# EAGLE schematic kocka1 (EAGLE 7.2.0)

## Sheet 1 of 2
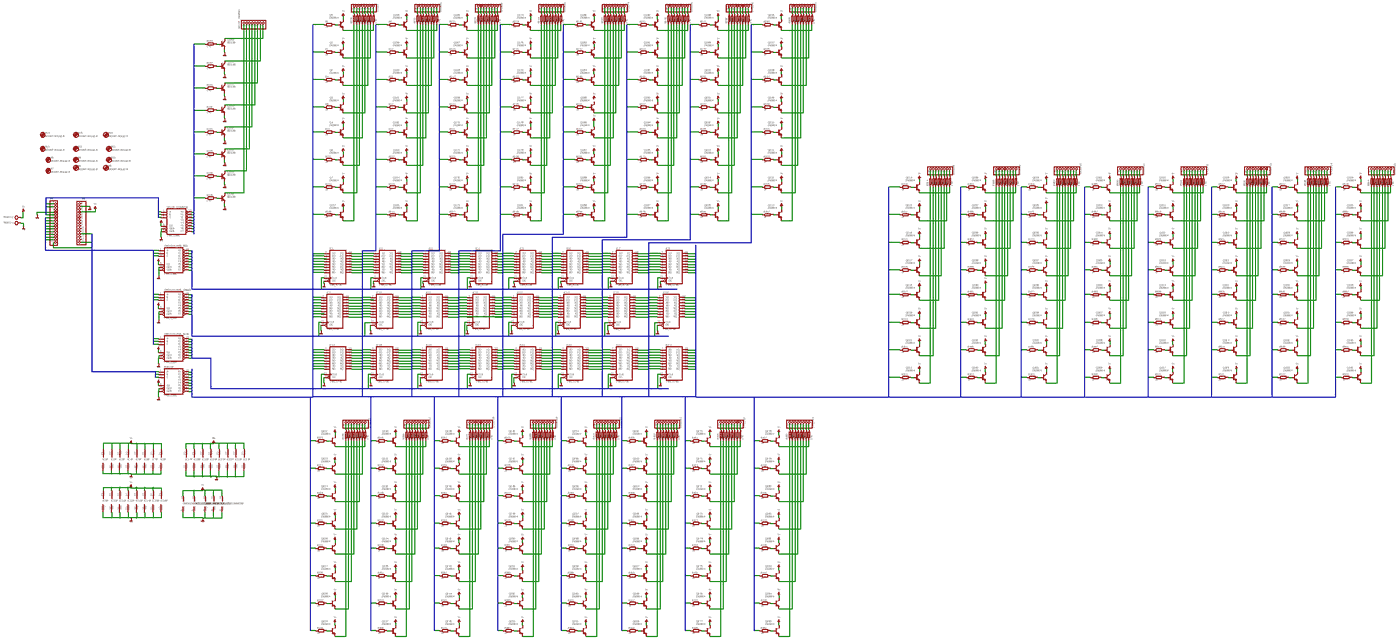
[diagram p0: schematic, sheet 1, overview]
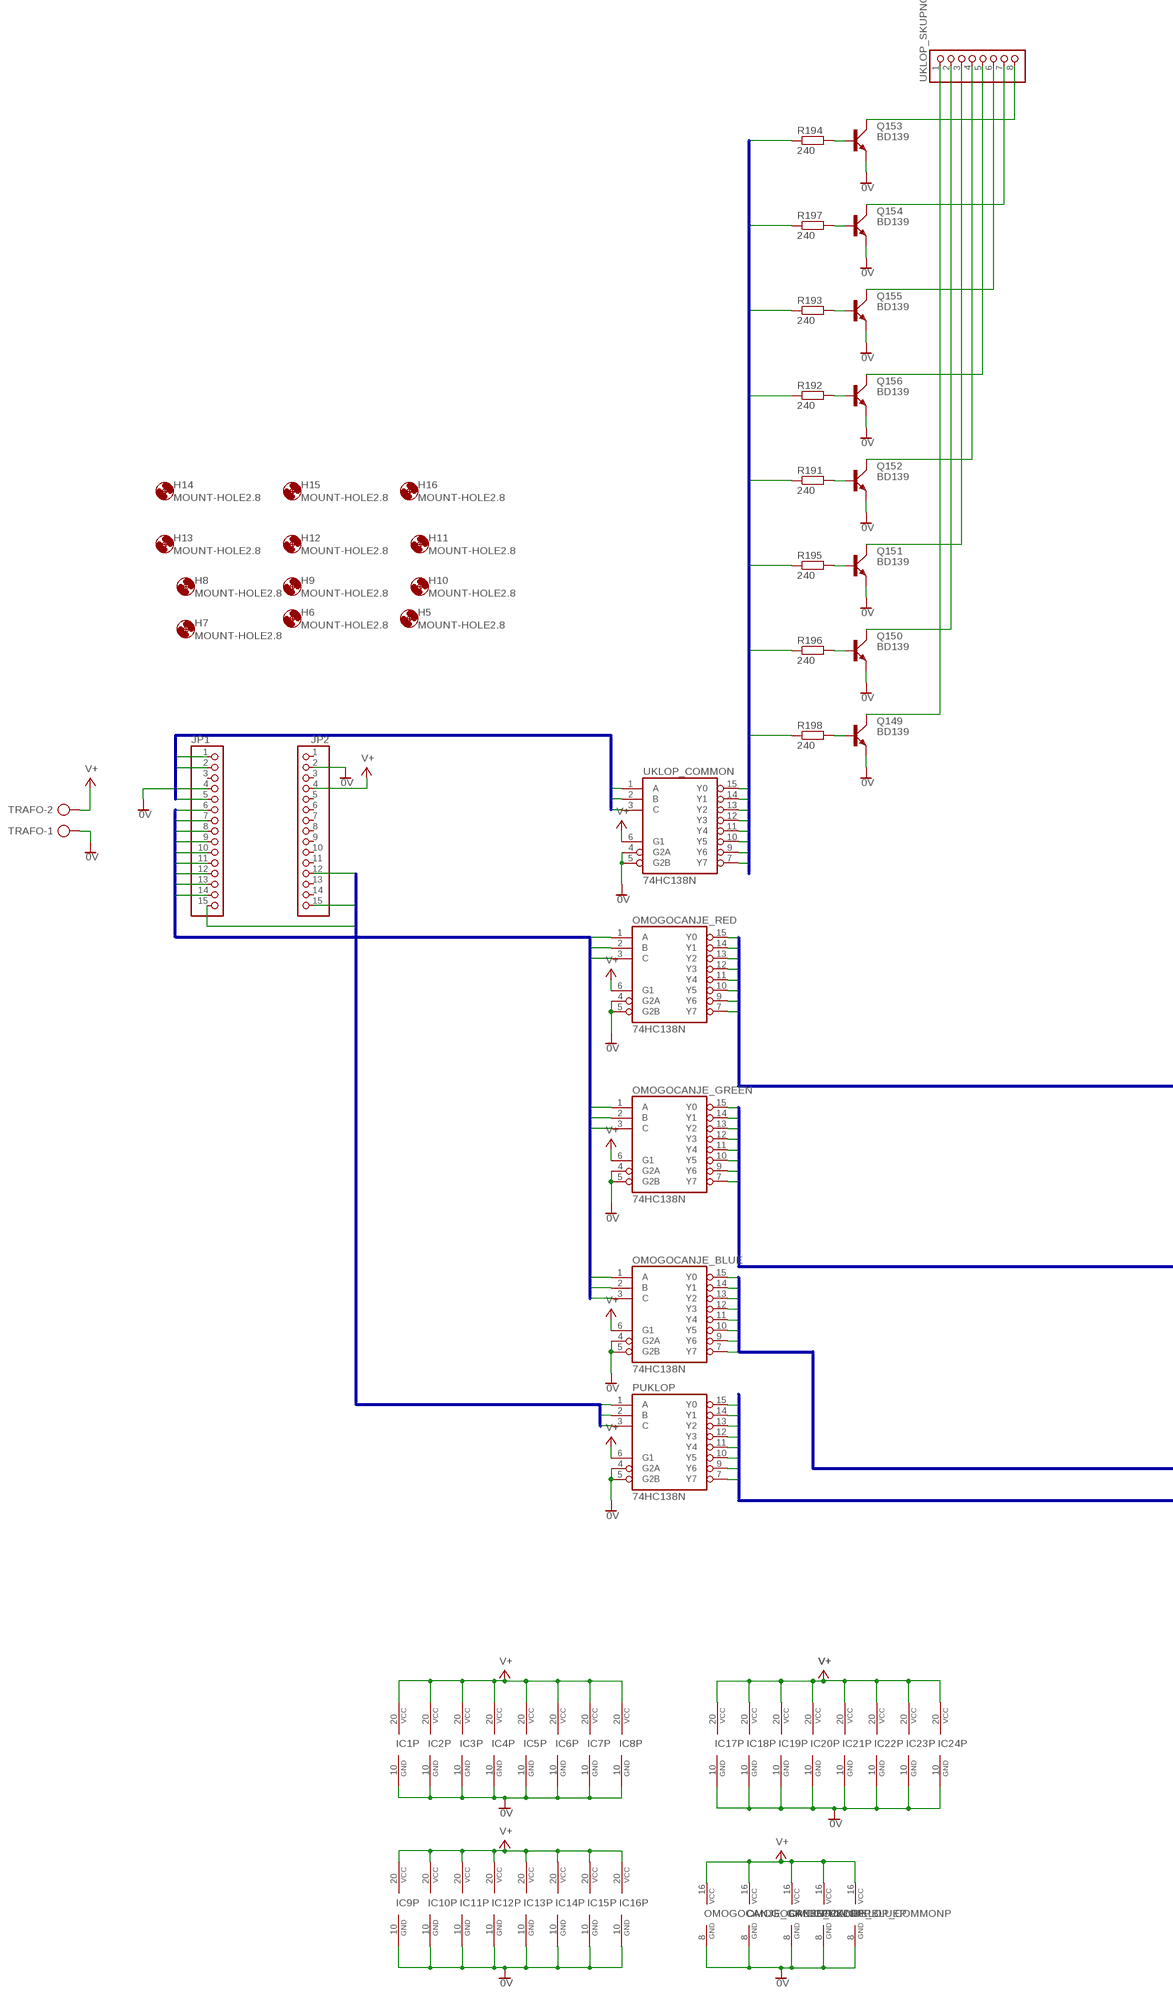
[diagram p1: schematic, sheet 1, part 1 of 4]
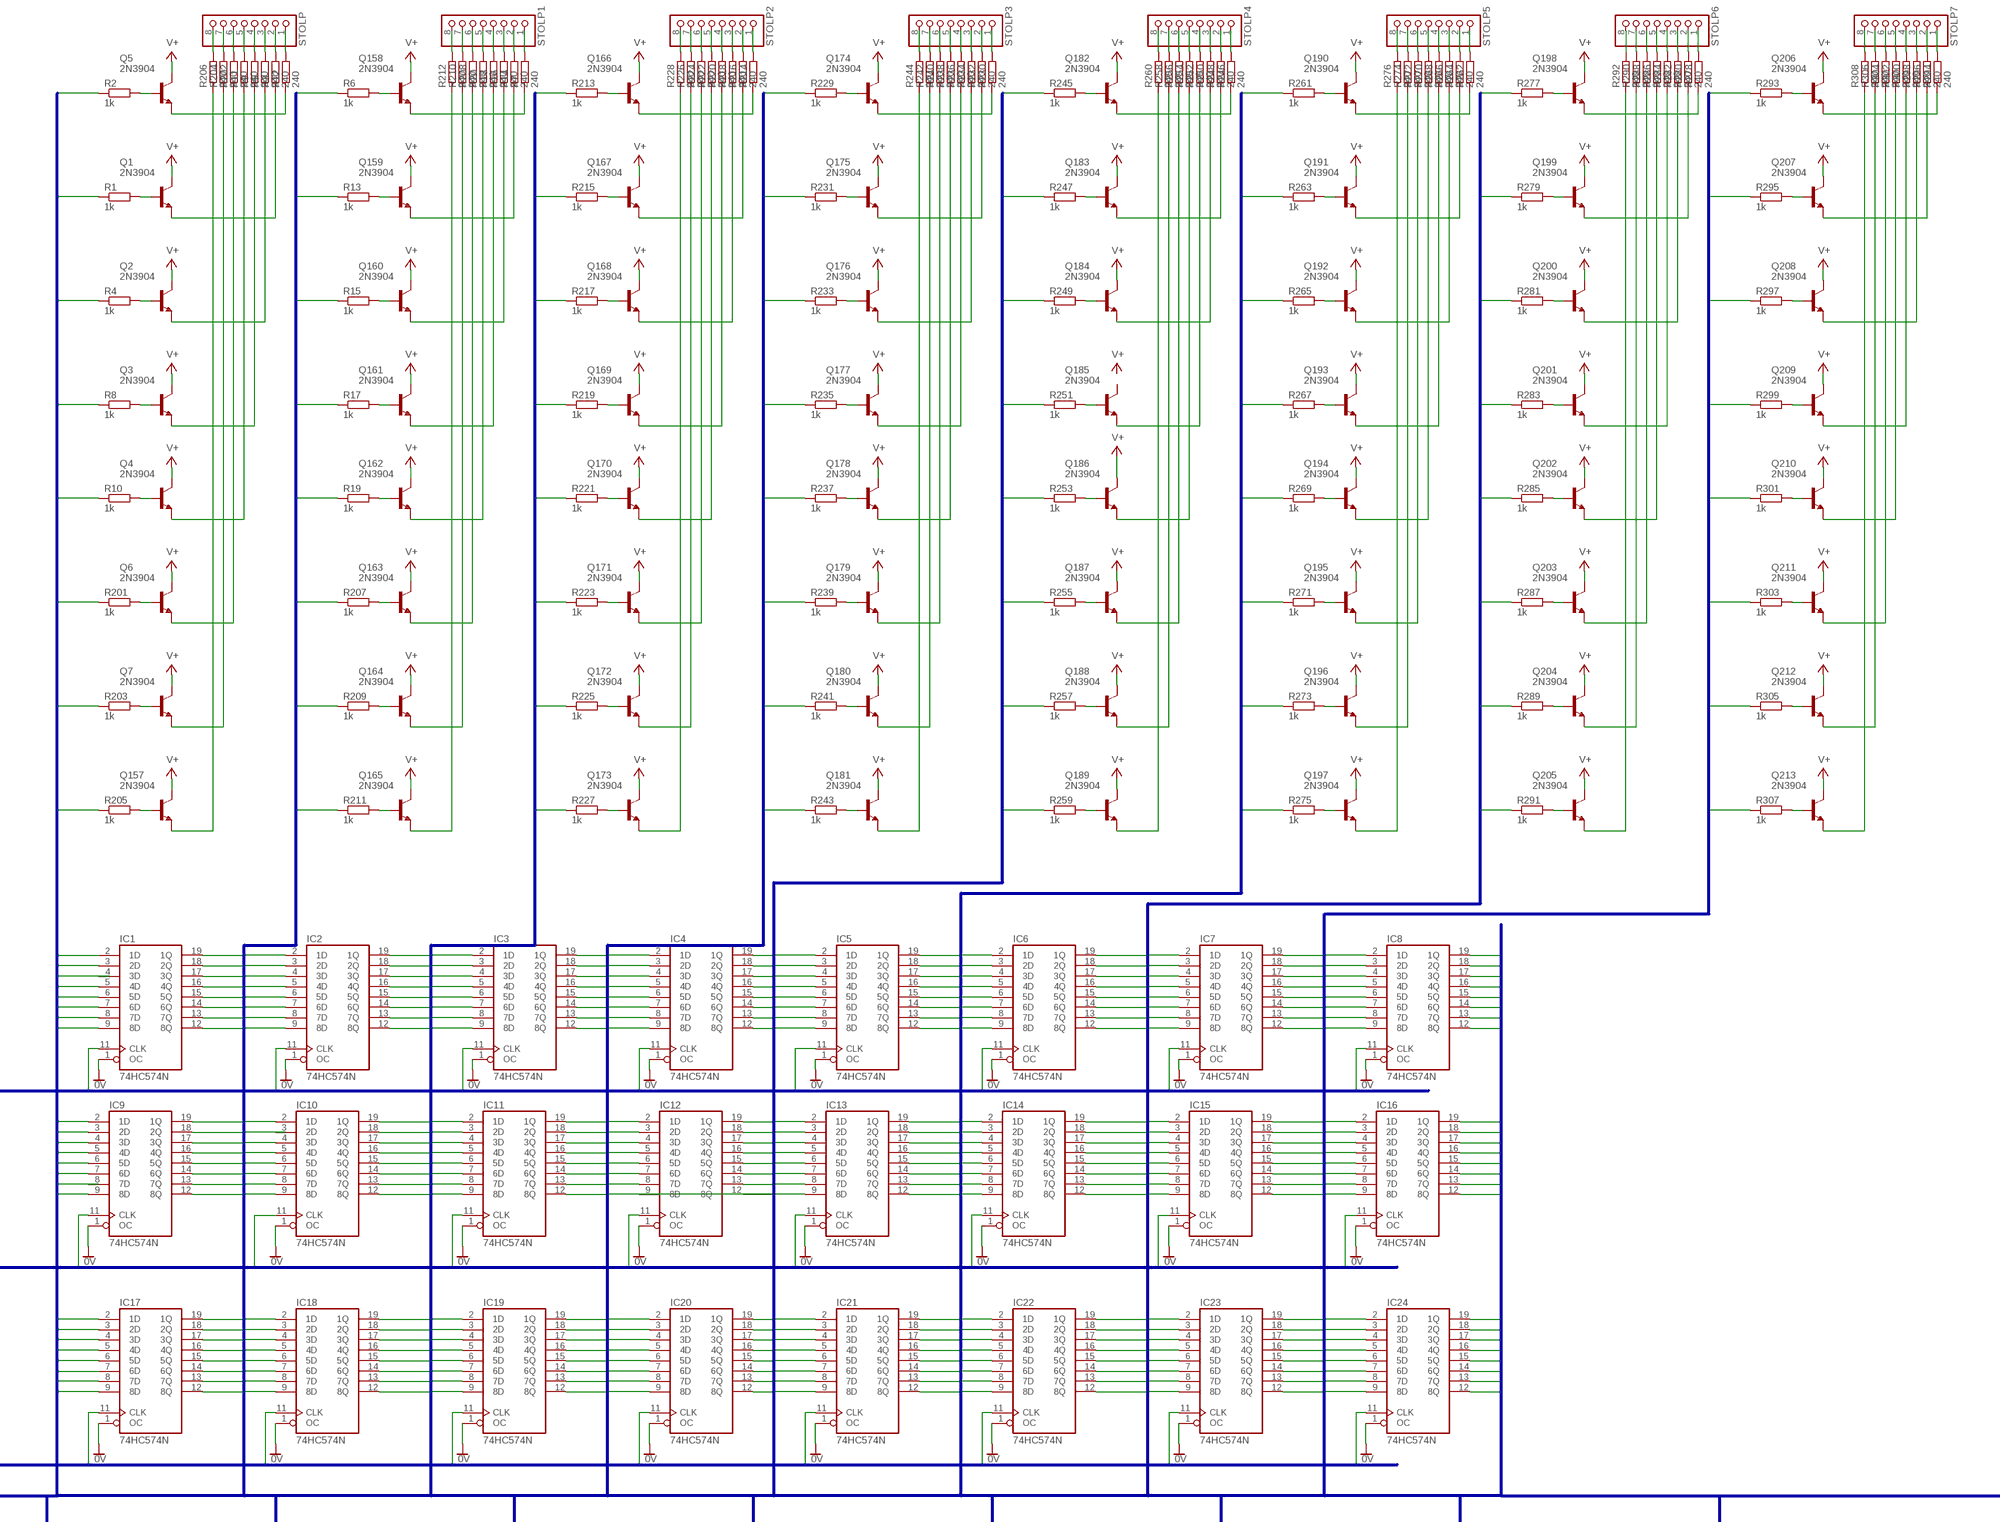
[diagram p2: schematic, sheet 1, part 2 of 4]
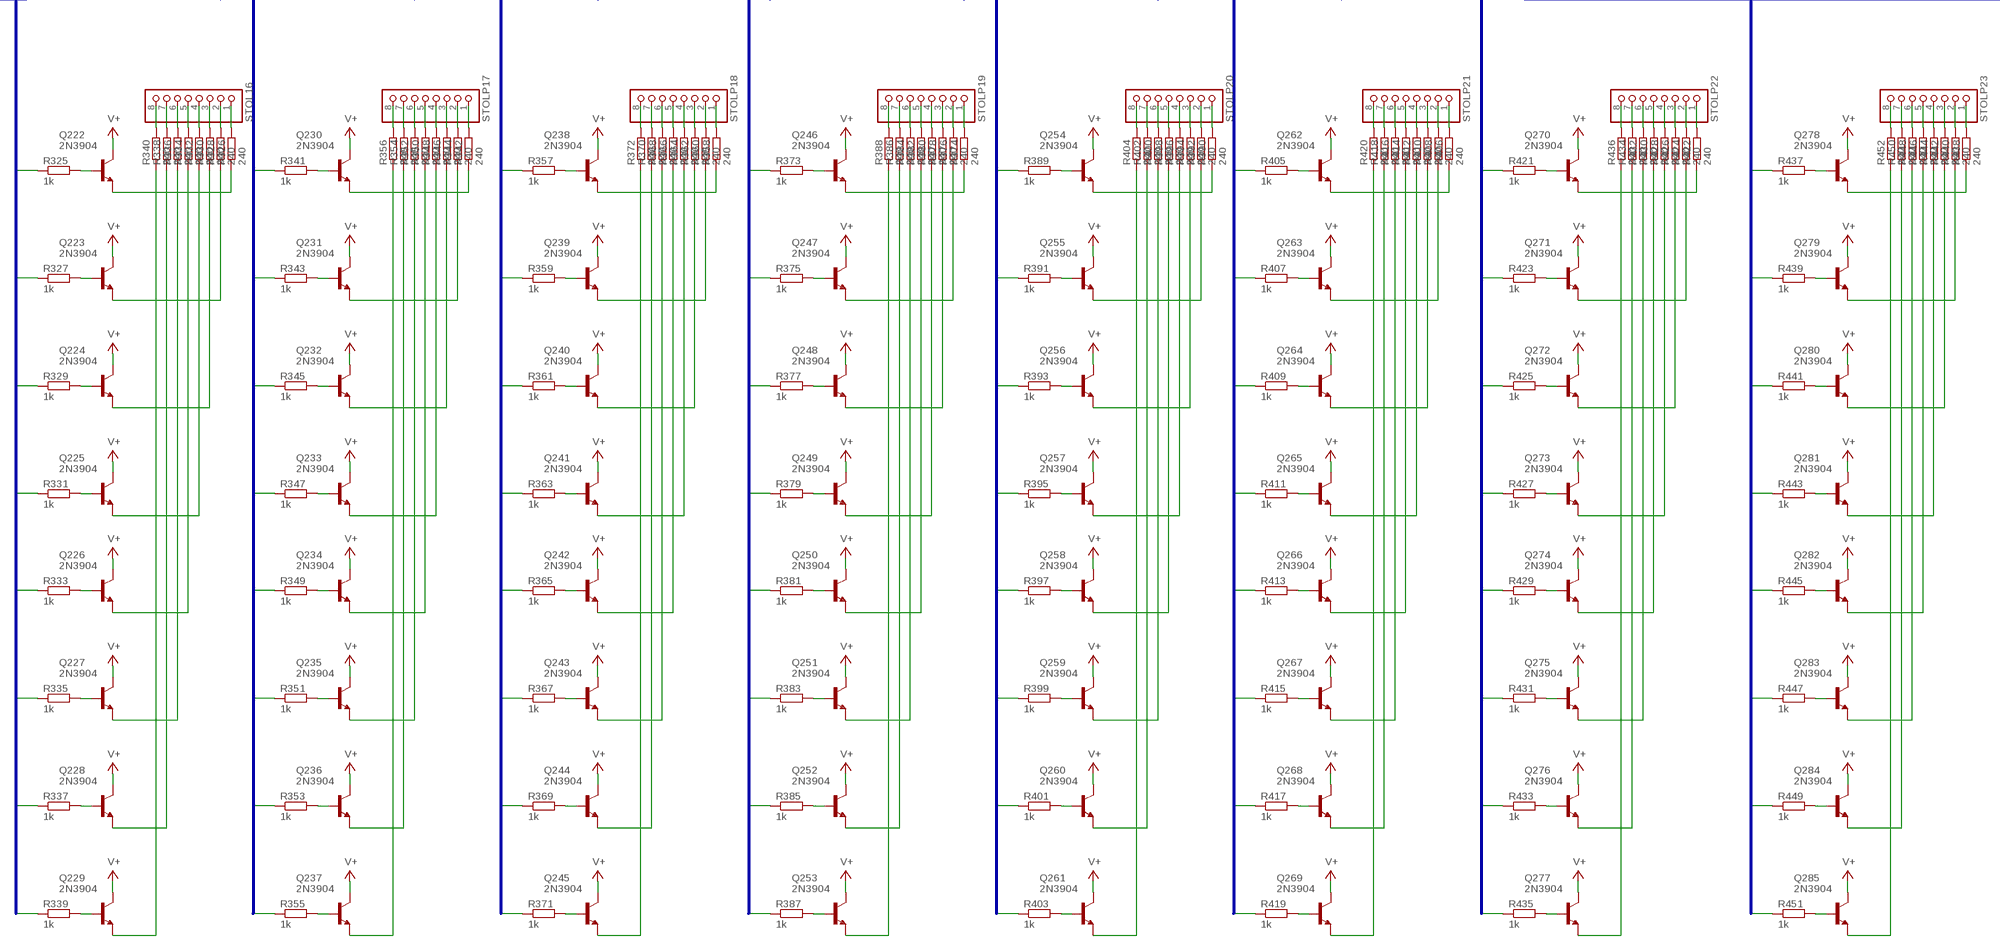
[diagram p3: schematic, sheet 1, part 3 of 4]
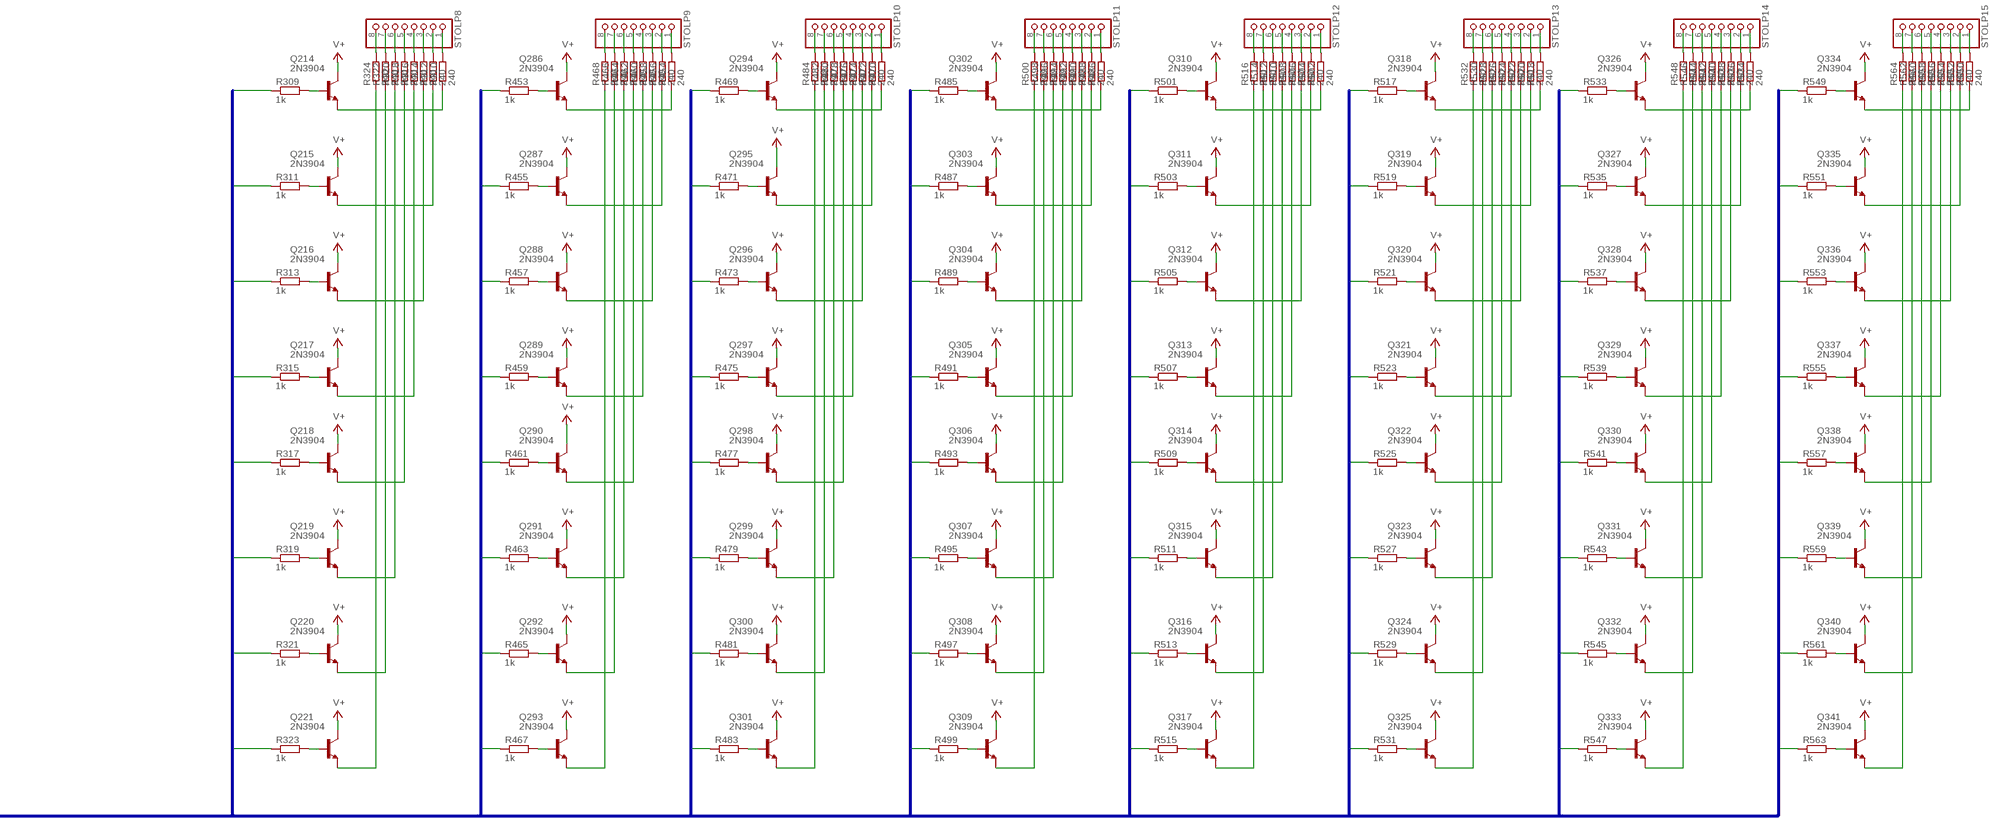
[diagram p4: schematic, sheet 1, part 4 of 4]

### Parts
H5  MOUNT-HOLE2.8  [2,8]
H6  MOUNT-HOLE2.8  [2,8]
H7  MOUNT-HOLE2.8  [2,8]
H8  MOUNT-HOLE2.8  [2,8]
H9  MOUNT-HOLE2.8  [2,8]
H10  MOUNT-HOLE2.8  [2,8]
H11  MOUNT-HOLE2.8  [2,8]
H12  MOUNT-HOLE2.8  [2,8]
H13  MOUNT-HOLE2.8  [2,8]
H14  MOUNT-HOLE2.8  [2,8]
H15  MOUNT-HOLE2.8  [2,8]
H16  MOUNT-HOLE2.8  [2,8]
IC1  74HC574N  [DIL20]
IC2  74HC574N  [DIL20]
IC3  74HC574N  [DIL20]
IC4  74HC574N  [DIL20]
IC5  74HC574N  [DIL20]
IC6  74HC574N  [DIL20]
IC7  74HC574N  [DIL20]
IC8  74HC574N  [DIL20]
IC9  74HC574N  [DIL20]
IC10  74HC574N  [DIL20]
IC11  74HC574N  [DIL20]
IC12  74HC574N  [DIL20]
IC13  74HC574N  [DIL20]
IC14  74HC574N  [DIL20]
IC15  74HC574N  [DIL20]
IC16  74HC574N  [DIL20]
IC17  74HC574N  [DIL20]
IC18  74HC574N  [DIL20]
IC19  74HC574N  [DIL20]
IC20  74HC574N  [DIL20]
IC21  74HC574N  [DIL20]
IC22  74HC574N  [DIL20]
IC23  74HC574N  [DIL20]
IC24  74HC574N  [DIL20]
JP1  PINHD-1X15  [1X15]
JP2  PINHD-1X15  [1X15]
OMOGOCANJE_BLUE  74HC138N  [DIL16]
OMOGOCANJE_GREEN  74HC138N  [DIL16]
OMOGOCANJE_RED  74HC138N  [DIL16]
PUKLOP  74HC138N  [DIL16]
Q1  2N3904  [TO92]
Q2  2N3904  [TO92]
Q3  2N3904  [TO92]
Q4  2N3904  [TO92]
Q5  2N3904  [TO92]
Q6  2N3904  [TO92]
Q7  2N3904  [TO92]
Q149  BD139  [TO126AV]
Q150  BD139  [TO126AV]
Q151  BD139  [TO126AV]
Q152  BD139  [TO126AV]
Q153  BD139  [TO126AV]
Q154  BD139  [TO126AV]
Q155  BD139  [TO126AV]
Q156  BD139  [TO126AV]
Q157  2N3904  [TO92]
Q158  2N3904  [TO92]
Q159  2N3904  [TO92]
Q160  2N3904  [TO92]
Q161  2N3904  [TO92]
Q162  2N3904  [TO92]
Q163  2N3904  [TO92]
Q164  2N3904  [TO92]
Q165  2N3904  [TO92]
Q166  2N3904  [TO92]
Q167  2N3904  [TO92]
Q168  2N3904  [TO92]
Q169  2N3904  [TO92]
Q170  2N3904  [TO92]
Q171  2N3904  [TO92]
Q172  2N3904  [TO92]
Q173  2N3904  [TO92]
Q174  2N3904  [TO92]
Q175  2N3904  [TO92]
Q176  2N3904  [TO92]
Q177  2N3904  [TO92]
Q178  2N3904  [TO92]
Q179  2N3904  [TO92]
Q180  2N3904  [TO92]
Q181  2N3904  [TO92]
Q182  2N3904  [TO92]
Q183  2N3904  [TO92]
Q184  2N3904  [TO92]
Q185  2N3904  [TO92]
Q186  2N3904  [TO92]
Q187  2N3904  [TO92]
Q188  2N3904  [TO92]
Q189  2N3904  [TO92]
Q190  2N3904  [TO92]
Q191  2N3904  [TO92]
Q192  2N3904  [TO92]
Q193  2N3904  [TO92]
Q194  2N3904  [TO92]
Q195  2N3904  [TO92]
Q196  2N3904  [TO92]
Q197  2N3904  [TO92]
Q198  2N3904  [TO92]
Q199  2N3904  [TO92]
Q200  2N3904  [TO92]
Q201  2N3904  [TO92]
Q202  2N3904  [TO92]
Q203  2N3904  [TO92]
Q204  2N3904  [TO92]
Q205  2N3904  [TO92]
Q206  2N3904  [TO92]
Q207  2N3904  [TO92]
Q208  2N3904  [TO92]
Q209  2N3904  [TO92]
Q210  2N3904  [TO92]
Q211  2N3904  [TO92]
Q212  2N3904  [TO92]
Q213  2N3904  [TO92]
Q214  2N3904  [TO92]
Q215  2N3904  [TO92]
Q216  2N3904  [TO92]
Q217  2N3904  [TO92]
Q218  2N3904  [TO92]
Q219  2N3904  [TO92]
Q220  2N3904  [TO92]
Q221  2N3904  [TO92]
Q222  2N3904  [TO92]
Q223  2N3904  [TO92]
Q224  2N3904  [TO92]
Q225  2N3904  [TO92]
Q226  2N3904  [TO92]
Q227  2N3904  [TO92]
Q228  2N3904  [TO92]
Q229  2N3904  [TO92]
Q230  2N3904  [TO92]
Q231  2N3904  [TO92]
Q232  2N3904  [TO92]
Q233  2N3904  [TO92]
Q234  2N3904  [TO92]
Q235  2N3904  [TO92]
Q236  2N3904  [TO92]
Q237  2N3904  [TO92]
Q238  2N3904  [TO92]
Q239  2N3904  [TO92]
Q240  2N3904  [TO92]
Q241  2N3904  [TO92]
Q242  2N3904  [TO92]
Q243  2N3904  [TO92]
Q244  2N3904  [TO92]
Q245  2N3904  [TO92]
Q246  2N3904  [TO92]
Q247  2N3904  [TO92]
Q248  2N3904  [TO92]
Q249  2N3904  [TO92]
Q250  2N3904  [TO92]
Q251  2N3904  [TO92]
Q252  2N3904  [TO92]
Q253  2N3904  [TO92]
Q254  2N3904  [TO92]
Q255  2N3904  [TO92]
Q256  2N3904  [TO92]
Q257  2N3904  [TO92]
Q258  2N3904  [TO92]
Q259  2N3904  [TO92]
Q260  2N3904  [TO92]
Q261  2N3904  [TO92]
Q262  2N3904  [TO92]
Q263  2N3904  [TO92]
Q264  2N3904  [TO92]
Q265  2N3904  [TO92]
Q266  2N3904  [TO92]
Q267  2N3904  [TO92]
Q268  2N3904  [TO92]
Q269  2N3904  [TO92]
Q270  2N3904  [TO92]
Q271  2N3904  [TO92]
Q272  2N3904  [TO92]
Q273  2N3904  [TO92]
Q274  2N3904  [TO92]
Q275  2N3904  [TO92]
Q276  2N3904  [TO92]
Q277  2N3904  [TO92]
Q278  2N3904  [TO92]
Q279  2N3904  [TO92]
Q280  2N3904  [TO92]
Q281  2N3904  [TO92]
Q282  2N3904  [TO92]
Q283  2N3904  [TO92]
Q284  2N3904  [TO92]
Q285  2N3904  [TO92]
Q286  2N3904  [TO92]
Q287  2N3904  [TO92]
Q288  2N3904  [TO92]
Q289  2N3904  [TO92]
Q290  2N3904  [TO92]
Q291  2N3904  [TO92]
Q292  2N3904  [TO92]
Q293  2N3904  [TO92]
Q294  2N3904  [TO92]
Q295  2N3904  [TO92]
Q296  2N3904  [TO92]
Q297  2N3904  [TO92]
Q298  2N3904  [TO92]
Q299  2N3904  [TO92]
Q300  2N3904  [TO92]
Q301  2N3904  [TO92]
Q302  2N3904  [TO92]
Q303  2N3904  [TO92]
Q304  2N3904  [TO92]
Q305  2N3904  [TO92]
Q306  2N3904  [TO92]
Q307  2N3904  [TO92]
Q308  2N3904  [TO92]
Q309  2N3904  [TO92]
Q310  2N3904  [TO92]
Q311  2N3904  [TO92]
Q312  2N3904  [TO92]
Q313  2N3904  [TO92]
Q314  2N3904  [TO92]
Q315  2N3904  [TO92]
Q316  2N3904  [TO92]
Q317  2N3904  [TO92]
Q318  2N3904  [TO92]
Q319  2N3904  [TO92]
Q320  2N3904  [TO92]
Q321  2N3904  [TO92]
Q322  2N3904  [TO92]
Q323  2N3904  [TO92]
Q324  2N3904  [TO92]
Q325  2N3904  [TO92]
Q326  2N3904  [TO92]
Q327  2N3904  [TO92]
Q328  2N3904  [TO92]
Q329  2N3904  [TO92]
Q330  2N3904  [TO92]
Q331  2N3904  [TO92]
Q332  2N3904  [TO92]
Q333  2N3904  [TO92]
Q334  2N3904  [TO92]
Q335  2N3904  [TO92]
Q336  2N3904  [TO92]
Q337  2N3904  [TO92]
Q338  2N3904  [TO92]
Q339  2N3904  [TO92]
Q340  2N3904  [TO92]
Q341  2N3904  [TO92]
R1  1k  R-EU_0207/10  [0207/10]
R2  1k  R-EU_0207/10  [0207/10]
R3  240  R-EU_0207/10  [0207/10]
R4  1k  R-EU_0207/10  [0207/10]
R5  240  R-EU_0207/10  [0207/10]
R6  1k  R-EU_0207/10  [0207/10]
R7  240  R-EU_0207/10  [0207/10]
R8  1k  R-EU_0207/10  [0207/10]
R9  240  R-EU_0207/10  [0207/10]
R10  1k  R-EU_0207/10  [0207/10]
R11  240  R-EU_0207/10  [0207/10]
R12  240  R-EU_0207/10  [0207/10]
R13  1k  R-EU_0207/10  [0207/10]
R14  240  R-EU_0207/10  [0207/10]
R15  1k  R-EU_0207/10  [0207/10]
R16  240  R-EU_0207/10  [0207/10]
R17  1k  R-EU_0207/10  [0207/10]
R18  240  R-EU_0207/10  [0207/10]
R19  1k  R-EU_0207/10  [0207/10]
R20  240  R-EU_0207/10  [0207/10]
R191  240  R-EU_0207/10  [0207/10]
R192  240  R-EU_0207/10  [0207/10]
R193  240  R-EU_0207/10  [0207/10]
R194  240  R-EU_0207/10  [0207/10]
R195  240  R-EU_0207/10  [0207/10]
R196  240  R-EU_0207/10  [0207/10]
R197  240  R-EU_0207/10  [0207/10]
R198  240  R-EU_0207/10  [0207/10]
R201  1k  R-EU_0207/10  [0207/10]
R202  240  R-EU_0207/10  [0207/10]
R203  1k  R-EU_0207/10  [0207/10]
R204  240  R-EU_0207/10  [0207/10]
R205  1k  R-EU_0207/10  [0207/10]
R206  240  R-EU_0207/10  [0207/10]
R207  1k  R-EU_0207/10  [0207/10]
R208  240  R-EU_0207/10  [0207/10]
R209  1k  R-EU_0207/10  [0207/10]
R210  240  R-EU_0207/10  [0207/10]
R211  1k  R-EU_0207/10  [0207/10]
R212  240  R-EU_0207/10  [0207/10]
R213  1k  R-EU_0207/10  [0207/10]
R214  240  R-EU_0207/10  [0207/10]
R215  1k  R-EU_0207/10  [0207/10]
R216  240  R-EU_0207/10  [0207/10]
R217  1k  R-EU_0207/10  [0207/10]
R218  240  R-EU_0207/10  [0207/10]
R219  1k  R-EU_0207/10  [0207/10]
R220  240  R-EU_0207/10  [0207/10]
R221  1k  R-EU_0207/10  [0207/10]
R222  240  R-EU_0207/10  [0207/10]
R223  1k  R-EU_0207/10  [0207/10]
R224  240  R-EU_0207/10  [0207/10]
R225  1k  R-EU_0207/10  [0207/10]
R226  240  R-EU_0207/10  [0207/10]
R227  1k  R-EU_0207/10  [0207/10]
R228  240  R-EU_0207/10  [0207/10]
R229  1k  R-EU_0207/10  [0207/10]
R230  240  R-EU_0207/10  [0207/10]
R231  1k  R-EU_0207/10  [0207/10]
R232  240  R-EU_0207/10  [0207/10]
R233  1k  R-EU_0207/10  [0207/10]
R234  240  R-EU_0207/10  [0207/10]
R235  1k  R-EU_0207/10  [0207/10]
R236  240  R-EU_0207/10  [0207/10]
R237  1k  R-EU_0207/10  [0207/10]
R238  240  R-EU_0207/10  [0207/10]
R239  1k  R-EU_0207/10  [0207/10]
R240  240  R-EU_0207/10  [0207/10]
R241  1k  R-EU_0207/10  [0207/10]
R242  240  R-EU_0207/10  [0207/10]
R243  1k  R-EU_0207/10  [0207/10]
R244  240  R-EU_0207/10  [0207/10]
R245  1k  R-EU_0207/10  [0207/10]
R246  240  R-EU_0207/10  [0207/10]
R247  1k  R-EU_0207/10  [0207/10]
R248  240  R-EU_0207/10  [0207/10]
R249  1k  R-EU_0207/10  [0207/10]
R250  240  R-EU_0207/10  [0207/10]
R251  1k  R-EU_0207/10  [0207/10]
R252  240  R-EU_0207/10  [0207/10]
R253  1k  R-EU_0207/10  [0207/10]
R254  240  R-EU_0207/10  [0207/10]
R255  1k  R-EU_0207/10  [0207/10]
R256  240  R-EU_0207/10  [0207/10]
R257  1k  R-EU_0207/10  [0207/10]
R258  240  R-EU_0207/10  [0207/10]
R259  1k  R-EU_0207/10  [0207/10]
R260  240  R-EU_0207/10  [0207/10]
R261  1k  R-EU_0207/10  [0207/10]
R262  240  R-EU_0207/10  [0207/10]
R263  1k  R-EU_0207/10  [0207/10]
R264  240  R-EU_0207/10  [0207/10]
R265  1k  R-EU_0207/10  [0207/10]
R266  240  R-EU_0207/10  [0207/10]
R267  1k  R-EU_0207/10  [0207/10]
R268  240  R-EU_0207/10  [0207/10]
R269  1k  R-EU_0207/10  [0207/10]
R270  240  R-EU_0207/10  [0207/10]
R271  1k  R-EU_0207/10  [0207/10]
R272  240  R-EU_0207/10  [0207/10]
R273  1k  R-EU_0207/10  [0207/10]
R274  240  R-EU_0207/10  [0207/10]
R275  1k  R-EU_0207/10  [0207/10]
R276  240  R-EU_0207/10  [0207/10]
R277  1k  R-EU_0207/10  [0207/10]
R278  240  R-EU_0207/10  [0207/10]
R279  1k  R-EU_0207/10  [0207/10]
R280  240  R-EU_0207/10  [0207/10]
R281  1k  R-EU_0207/10  [0207/10]
R282  240  R-EU_0207/10  [0207/10]
R283  1k  R-EU_0207/10  [0207/10]
R284  240  R-EU_0207/10  [0207/10]
R285  1k  R-EU_0207/10  [0207/10]
R286  240  R-EU_0207/10  [0207/10]
R287  1k  R-EU_0207/10  [0207/10]
R288  240  R-EU_0207/10  [0207/10]
R289  1k  R-EU_0207/10  [0207/10]
R290  240  R-EU_0207/10  [0207/10]
R291  1k  R-EU_0207/10  [0207/10]
R292  240  R-EU_0207/10  [0207/10]
R293  1k  R-EU_0207/10  [0207/10]
R294  240  R-EU_0207/10  [0207/10]
R295  1k  R-EU_0207/10  [0207/10]
R296  240  R-EU_0207/10  [0207/10]
R297  1k  R-EU_0207/10  [0207/10]
R298  240  R-EU_0207/10  [0207/10]
R299  1k  R-EU_0207/10  [0207/10]
R300  240  R-EU_0207/10  [0207/10]
R301  1k  R-EU_0207/10  [0207/10]
R302  240  R-EU_0207/10  [0207/10]
R303  1k  R-EU_0207/10  [0207/10]
R304  240  R-EU_0207/10  [0207/10]
R305  1k  R-EU_0207/10  [0207/10]
R306  240  R-EU_0207/10  [0207/10]
R307  1k  R-EU_0207/10  [0207/10]
R308  240  R-EU_0207/10  [0207/10]
R309  1k  R-EU_0207/10  [0207/10]
R310  240  R-EU_0207/10  [0207/10]
R311  1k  R-EU_0207/10  [0207/10]
R312  240  R-EU_0207/10  [0207/10]
R313  1k  R-EU_0207/10  [0207/10]
R314  240  R-EU_0207/10  [0207/10]
R315  1k  R-EU_0207/10  [0207/10]
R316  240  R-EU_0207/10  [0207/10]
R317  1k  R-EU_0207/10  [0207/10]
R318  240  R-EU_0207/10  [0207/10]
R319  1k  R-EU_0207/10  [0207/10]
R320  240  R-EU_0207/10  [0207/10]
R321  1k  R-EU_0207/10  [0207/10]
R322  240  R-EU_0207/10  [0207/10]
R323  1k  R-EU_0207/10  [0207/10]
R324  240  R-EU_0207/10  [0207/10]
R325  1k  R-EU_0207/10  [0207/10]
R326  240  R-EU_0207/10  [0207/10]
R327  1k  R-EU_0207/10  [0207/10]
R328  240  R-EU_0207/10  [0207/10]
R329  1k  R-EU_0207/10  [0207/10]
R330  240  R-EU_0207/10  [0207/10]
R331  1k  R-EU_0207/10  [0207/10]
R332  240  R-EU_0207/10  [0207/10]
R333  1k  R-EU_0207/10  [0207/10]
R334  240  R-EU_0207/10  [0207/10]
R335  1k  R-EU_0207/10  [0207/10]
R336  240  R-EU_0207/10  [0207/10]
R337  1k  R-EU_0207/10  [0207/10]
R338  240  R-EU_0207/10  [0207/10]
R339  1k  R-EU_0207/10  [0207/10]
R340  240  R-EU_0207/10  [0207/10]
R341  1k  R-EU_0207/10  [0207/10]
R342  240  R-EU_0207/10  [0207/10]
R343  1k  R-EU_0207/10  [0207/10]
R344  240  R-EU_0207/10  [0207/10]
R345  1k  R-EU_0207/10  [0207/10]
R346  240  R-EU_0207/10  [0207/10]
R347  1k  R-EU_0207/10  [0207/10]
R348  240  R-EU_0207/10  [0207/10]
R349  1k  R-EU_0207/10  [0207/10]
R350  240  R-EU_0207/10  [0207/10]
R351  1k  R-EU_0207/10  [0207/10]
R352  240  R-EU_0207/10  [0207/10]
R353  1k  R-EU_0207/10  [0207/10]
R354  240  R-EU_0207/10  [0207/10]
R355  1k  R-EU_0207/10  [0207/10]
R356  240  R-EU_0207/10  [0207/10]
R357  1k  R-EU_0207/10  [0207/10]
R358  240  R-EU_0207/10  [0207/10]
R359  1k  R-EU_0207/10  [0207/10]
R360  240  R-EU_0207/10  [0207/10]
R361  1k  R-EU_0207/10  [0207/10]
R362  240  R-EU_0207/10  [0207/10]
R363  1k  R-EU_0207/10  [0207/10]
R364  240  R-EU_0207/10  [0207/10]
R365  1k  R-EU_0207/10  [0207/10]
R366  240  R-EU_0207/10  [0207/10]
R367  1k  R-EU_0207/10  [0207/10]
R368  240  R-EU_0207/10  [0207/10]
R369  1k  R-EU_0207/10  [0207/10]
R370  240  R-EU_0207/10  [0207/10]
R371  1k  R-EU_0207/10  [0207/10]
R372  240  R-EU_0207/10  [0207/10]
R373  1k  R-EU_0207/10  [0207/10]
R374  240  R-EU_0207/10  [0207/10]
R375  1k  R-EU_0207/10  [0207/10]
R376  240  R-EU_0207/10  [0207/10]
R377  1k  R-EU_0207/10  [0207/10]
R378  240  R-EU_0207/10  [0207/10]
R379  1k  R-EU_0207/10  [0207/10]
R380  240  R-EU_0207/10  [0207/10]
R381  1k  R-EU_0207/10  [0207/10]
R382  240  R-EU_0207/10  [0207/10]
R383  1k  R-EU_0207/10  [0207/10]
R384  240  R-EU_0207/10  [0207/10]
R385  1k  R-EU_0207/10  [0207/10]
R386  240  R-EU_0207/10  [0207/10]
R387  1k  R-EU_0207/10  [0207/10]
R388  240  R-EU_0207/10  [0207/10]
R389  1k  R-EU_0207/10  [0207/10]
R390  240  R-EU_0207/10  [0207/10]
R391  1k  R-EU_0207/10  [0207/10]
R392  240  R-EU_0207/10  [0207/10]
R393  1k  R-EU_0207/10  [0207/10]
R394  240  R-EU_0207/10  [0207/10]
R395  1k  R-EU_0207/10  [0207/10]
R396  240  R-EU_0207/10  [0207/10]
R397  1k  R-EU_0207/10  [0207/10]
R398  240  R-EU_0207/10  [0207/10]
R399  1k  R-EU_0207/10  [0207/10]
R400  240  R-EU_0207/10  [0207/10]
R401  1k  R-EU_0207/10  [0207/10]
R402  240  R-EU_0207/10  [0207/10]
R403  1k  R-EU_0207/10  [0207/10]
R404  240  R-EU_0207/10  [0207/10]
R405  1k  R-EU_0207/10  [0207/10]
R406  240  R-EU_0207/10  [0207/10]
R407  1k  R-EU_0207/10  [0207/10]
R408  240  R-EU_0207/10  [0207/10]
R409  1k  R-EU_0207/10  [0207/10]
R410  240  R-EU_0207/10  [0207/10]
R411  1k  R-EU_0207/10  [0207/10]
R412  240  R-EU_0207/10  [0207/10]
R413  1k  R-EU_0207/10  [0207/10]
R414  240  R-EU_0207/10  [0207/10]
R415  1k  R-EU_0207/10  [0207/10]
R416  240  R-EU_0207/10  [0207/10]
R417  1k  R-EU_0207/10  [0207/10]
R418  240  R-EU_0207/10  [0207/10]
R419  1k  R-EU_0207/10  [0207/10]
R420  240  R-EU_0207/10  [0207/10]
R421  1k  R-EU_0207/10  [0207/10]
R422  240  R-EU_0207/10  [0207/10]
R423  1k  R-EU_0207/10  [0207/10]
R424  240  R-EU_0207/10  [0207/10]
R425  1k  R-EU_0207/10  [0207/10]
R426  240  R-EU_0207/10  [0207/10]
R427  1k  R-EU_0207/10  [0207/10]
R428  240  R-EU_0207/10  [0207/10]
R429  1k  R-EU_0207/10  [0207/10]
R430  240  R-EU_0207/10  [0207/10]
R431  1k  R-EU_0207/10  [0207/10]
R432  240  R-EU_0207/10  [0207/10]
R433  1k  R-EU_0207/10  [0207/10]
R434  240  R-EU_0207/10  [0207/10]
R435  1k  R-EU_0207/10  [0207/10]
R436  240  R-EU_0207/10  [0207/10]
R437  1k  R-EU_0207/10  [0207/10]
R438  240  R-EU_0207/10  [0207/10]
R439  1k  R-EU_0207/10  [0207/10]
R440  240  R-EU_0207/10  [0207/10]
R441  1k  R-EU_0207/10  [0207/10]
R442  240  R-EU_0207/10  [0207/10]
R443  1k  R-EU_0207/10  [0207/10]
R444  240  R-EU_0207/10  [0207/10]
R445  1k  R-EU_0207/10  [0207/10]
R446  240  R-EU_0207/10  [0207/10]
R447  1k  R-EU_0207/10  [0207/10]
R448  240  R-EU_0207/10  [0207/10]
R449  1k  R-EU_0207/10  [0207/10]
R450  240  R-EU_0207/10  [0207/10]
R451  1k  R-EU_0207/10  [0207/10]
R452  240  R-EU_0207/10  [0207/10]
R453  1k  R-EU_0207/10  [0207/10]
R454  240  R-EU_0207/10  [0207/10]
R455  1k  R-EU_0207/10  [0207/10]
R456  240  R-EU_0207/10  [0207/10]
R457  1k  R-EU_0207/10  [0207/10]
R458  240  R-EU_0207/10  [0207/10]
R459  1k  R-EU_0207/10  [0207/10]
R460  240  R-EU_0207/10  [0207/10]
R461  1k  R-EU_0207/10  [0207/10]
R462  240  R-EU_0207/10  [0207/10]
R463  1k  R-EU_0207/10  [0207/10]
R464  240  R-EU_0207/10  [0207/10]
R465  1k  R-EU_0207/10  [0207/10]
R466  240  R-EU_0207/10  [0207/10]
R467  1k  R-EU_0207/10  [0207/10]
R468  240  R-EU_0207/10  [0207/10]
R469  1k  R-EU_0207/10  [0207/10]
R470  240  R-EU_0207/10  [0207/10]
R471  1k  R-EU_0207/10  [0207/10]
R472  240  R-EU_0207/10  [0207/10]
R473  1k  R-EU_0207/10  [0207/10]
R474  240  R-EU_0207/10  [0207/10]
R475  1k  R-EU_0207/10  [0207/10]
R476  240  R-EU_0207/10  [0207/10]
R477  1k  R-EU_0207/10  [0207/10]
R478  240  R-EU_0207/10  [0207/10]
R479  1k  R-EU_0207/10  [0207/10]
R480  240  R-EU_0207/10  [0207/10]
R481  1k  R-EU_0207/10  [0207/10]
R482  240  R-EU_0207/10  [0207/10]
R483  1k  R-EU_0207/10  [0207/10]
R484  240  R-EU_0207/10  [0207/10]
R485  1k  R-EU_0207/10  [0207/10]
R486  240  R-EU_0207/10  [0207/10]
R487  1k  R-EU_0207/10  [0207/10]
R488  240  R-EU_0207/10  [0207/10]
R489  1k  R-EU_0207/10  [0207/10]
R490  240  R-EU_0207/10  [0207/10]
R491  1k  R-EU_0207/10  [0207/10]
R492  240  R-EU_0207/10  [0207/10]
R493  1k  R-EU_0207/10  [0207/10]
R494  240  R-EU_0207/10  [0207/10]
R495  1k  R-EU_0207/10  [0207/10]
R496  240  R-EU_0207/10  [0207/10]
R497  1k  R-EU_0207/10  [0207/10]
R498  240  R-EU_0207/10  [0207/10]
R499  1k  R-EU_0207/10  [0207/10]
R500  240  R-EU_0207/10  [0207/10]
R501  1k  R-EU_0207/10  [0207/10]
R502  240  R-EU_0207/10  [0207/10]
R503  1k  R-EU_0207/10  [0207/10]
R504  240  R-EU_0207/10  [0207/10]
R505  1k  R-EU_0207/10  [0207/10]
R506  240  R-EU_0207/10  [0207/10]
R507  1k  R-EU_0207/10  [0207/10]
R508  240  R-EU_0207/10  [0207/10]
R509  1k  R-EU_0207/10  [0207/10]
R510  240  R-EU_0207/10  [0207/10]
R511  1k  R-EU_0207/10  [0207/10]
R512  240  R-EU_0207/10  [0207/10]
R513  1k  R-EU_0207/10  [0207/10]
R514  240  R-EU_0207/10  [0207/10]
R515  1k  R-EU_0207/10  [0207/10]
R516  240  R-EU_0207/10  [0207/10]
R517  1k  R-EU_0207/10  [0207/10]
R518  240  R-EU_0207/10  [0207/10]
R519  1k  R-EU_0207/10  [0207/10]
R520  240  R-EU_0207/10  [0207/10]
R521  1k  R-EU_0207/10  [0207/10]
R522  240  R-EU_0207/10  [0207/10]
R523  1k  R-EU_0207/10  [0207/10]
R524  240  R-EU_0207/10  [0207/10]
R525  1k  R-EU_0207/10  [0207/10]
R526  240  R-EU_0207/10  [0207/10]
R527  1k  R-EU_0207/10  [0207/10]
R528  240  R-EU_0207/10  [0207/10]
R529  1k  R-EU_0207/10  [0207/10]
R530  240  R-EU_0207/10  [0207/10]
R531  1k  R-EU_0207/10  [0207/10]
R532  240  R-EU_0207/10  [0207/10]
R533  1k  R-EU_0207/10  [0207/10]
R534  240  R-EU_0207/10  [0207/10]
R535  1k  R-EU_0207/10  [0207/10]
R536  240  R-EU_0207/10  [0207/10]
R537  1k  R-EU_0207/10  [0207/10]
R538  240  R-EU_0207/10  [0207/10]
R539  1k  R-EU_0207/10  [0207/10]
R540  240  R-EU_0207/10  [0207/10]
R541  1k  R-EU_0207/10  [0207/10]
R542  240  R-EU_0207/10  [0207/10]
R543  1k  R-EU_0207/10  [0207/10]
R544  240  R-EU_0207/10  [0207/10]
R545  1k  R-EU_0207/10  [0207/10]
R546  240  R-EU_0207/10  [0207/10]
R547  1k  R-EU_0207/10  [0207/10]
R548  240  R-EU_0207/10  [0207/10]
R549  1k  R-EU_0207/10  [0207/10]
R550  240  R-EU_0207/10  [0207/10]
R551  1k  R-EU_0207/10  [0207/10]
R552  240  R-EU_0207/10  [0207/10]
R553  1k  R-EU_0207/10  [0207/10]
R554  240  R-EU_0207/10  [0207/10]
R555  1k  R-EU_0207/10  [0207/10]
R556  240  R-EU_0207/10  [0207/10]
R557  1k  R-EU_0207/10  [0207/10]
R558  240  R-EU_0207/10  [0207/10]
R559  1k  R-EU_0207/10  [0207/10]
R560  240  R-EU_0207/10  [0207/10]
R561  1k  R-EU_0207/10  [0207/10]
R562  240  R-EU_0207/10  [0207/10]
R563  1k  R-EU_0207/10  [0207/10]
R564  240  R-EU_0207/10  [0207/10]
STOL16  PINHD-1X8  [1X08]
STOLP  PINHD-1X8  [1X08]
STOLP1  PINHD-1X8  [1X08]
STOLP2  PINHD-1X8  [1X08]
STOLP3  PINHD-1X8  [1X08]
STOLP4  PINHD-1X8  [1X08]
STOLP5  PINHD-1X8  [1X08]
STOLP6  PINHD-1X8  [1X08]
STOLP7  PINHD-1X8  [1X08]
STOLP8  PINHD-1X8  [1X08]
STOLP9  PINHD-1X8  [1X08]
STOLP10  PINHD-1X8  [1X08]
STOLP11  PINHD-1X8  [1X08]
STOLP12  PINHD-1X8  [1X08]
STOLP13  PINHD-1X8  [1X08]
STOLP14  PINHD-1X8  [1X08]
STOLP15  PINHD-1X8  [1X08]
STOLP17  PINHD-1X8  [1X08]
STOLP18  PINHD-1X8  [1X08]
STOLP19  PINHD-1X8  [1X08]
STOLP20  PINHD-1X8  [1X08]
STOLP21  PINHD-1X8  [1X08]
STOLP22  PINHD-1X8  [1X08]
STOLP23  PINHD-1X8  [1X08]
TRAFO  AK300/2  [AK300/2]
UKLOP_COMMON  74HC138N  [DIL16]
UKLOP_SKUPNO  PINHD-1X8  [1X08]

### Nets
0V: IC1.1(OC) IC1.10(GND) IC2.1(OC) IC2.10(GND) IC3.1(OC) IC3.10(GND) IC4.1(OC) IC4.10(GND) IC5.1(OC) IC5.10(GND) IC6.1(OC) IC6.10(GND) IC7.1(OC) IC7.10(GND) IC8.1(OC) IC8.10(GND) IC9.1(OC) IC9.10(GND) IC10.1(OC) IC10.10(GND) IC11.1(OC) IC11.10(GND) IC12.1(OC) IC12.10(GND) IC13.1(OC) IC13.10(GND) IC14.1(OC) IC14.10(GND) IC15.1(OC) IC15.10(GND) IC16.1(OC) IC16.10(GND) IC17.1(OC) IC17.10(GND) IC18.1(OC) IC18.10(GND) IC19.1(OC) IC19.10(GND) IC20.1(OC) IC20.10(GND) IC21.1(OC) IC21.10(GND) IC22.1(OC) IC22.10(GND) IC23.1(OC) IC23.10(GND) IC24.1(OC) IC24.10(GND) JP1.4 JP2.2 OMOGOCANJE_BLUE.4(G2A) OMOGOCANJE_BLUE.5(G2B) OMOGOCANJE_BLUE.8(GND) OMOGOCANJE_GREEN.4(G2A) OMOGOCANJE_GREEN.5(G2B) OMOGOCANJE_GREEN.8(GND) OMOGOCANJE_RED.4(G2A) OMOGOCANJE_RED.5(G2B) OMOGOCANJE_RED.8(GND) PUKLOP.4(G2A) PUKLOP.5(G2B) PUKLOP.8(GND) Q149.E Q150.E Q151.E Q152.E Q153.E Q154.E Q155.E Q156.E TRAFO.1 UKLOP_COMMON.4(G2A) UKLOP_COMMON.5(G2B) UKLOP_COMMON.8(GND)
COMMON0: JP1.2 UKLOP_COMMON.3(C)
COMMON1: JP1.1 UKLOP_COMMON.2(B)
COMMON2: JP1.5 UKLOP_COMMON.1(A)
N$1: Q149.B R198.2
N$2: Q5.3(E) R12.1
N$3: Q150.B R196.2
N$4: Q151.B R195.2
N$5: Q152.B R191.2
N$6: Q156.B R192.2
N$7: Q155.B R193.2
N$8: Q154.B R197.2
N$9: Q153.B R194.2
N$10: Q153.C UKLOP_SKUPNO.8
N$11: Q154.C UKLOP_SKUPNO.7
N$12: Q155.C UKLOP_SKUPNO.6
N$13: Q156.C UKLOP_SKUPNO.5
N$14: Q152.C UKLOP_SKUPNO.4
N$15: Q151.C UKLOP_SKUPNO.3
N$16: Q150.C UKLOP_SKUPNO.2
N$17: Q149.C UKLOP_SKUPNO.1
N$18: Q5.2(B) R2.2
N$19: Q1.2(B) R1.2
N$20: Q1.3(E) R3.1
N$21: Q2.2(B) R4.2
N$22: Q2.3(E) R5.1
N$23: Q3.2(B) R8.2
N$24: Q3.3(E) R9.1
N$25: Q4.2(B) R10.2
N$26: Q4.3(E) R11.1
N$27: Q6.2(B) R201.2
N$28: Q6.3(E) R202.1
N$29: Q7.2(B) R203.2
N$30: Q7.3(E) R204.1
N$31: Q157.2(B) R205.2
N$32: Q157.3(E) R206.1
N$33: Q158.3(E) R7.1
N$34: Q159.3(E) R14.1
N$35: Q160.3(E) R16.1
N$36: Q161.3(E) R18.1
N$37: Q162.3(E) R20.1
N$38: Q163.3(E) R208.1
N$39: Q164.3(E) R210.1
N$40: Q165.3(E) R212.1
N$41: Q158.2(B) R6.2
N$42: R212.2 STOLP1.8
N$43: Q159.2(B) R13.2
N$44: R210.2 STOLP1.7
N$45: Q160.2(B) R15.2
N$46: R208.2 STOLP1.6
N$47: Q161.2(B) R17.2
N$48: R20.2 STOLP1.5
N$49: Q162.2(B) R19.2
N$50: R18.2 STOLP1.4
N$51: Q163.2(B) R207.2
N$52: R16.2 STOLP1.3
N$53: Q164.2(B) R209.2
N$54: R14.2 STOLP1.2
N$55: Q165.2(B) R211.2
N$56: R7.2 STOLP1.1
N$57: R206.2 STOLP.8
N$58: R204.2 STOLP.7
N$59: R202.2 STOLP.6
N$60: R11.2 STOLP.5
N$61: R9.2 STOLP.4
N$62: R5.2 STOLP.3
N$63: R3.2 STOLP.2
N$64: R12.2 STOLP.1
N$65: Q166.2(B) R213.2
N$66: R228.2 STOLP2.8
N$67: Q167.2(B) R215.2
N$68: R226.2 STOLP2.7
N$69: Q168.2(B) R217.2
N$70: R224.2 STOLP2.6
N$71: Q169.2(B) R219.2
N$72: R222.2 STOLP2.5
N$73: Q170.2(B) R221.2
N$74: R220.2 STOLP2.4
N$75: Q171.2(B) R223.2
N$76: R218.2 STOLP2.3
N$77: Q172.2(B) R225.2
N$78: R216.2 STOLP2.2
N$79: Q173.2(B) R227.2
N$80: R214.2 STOLP2.1
N$81: Q166.3(E) R214.1
N$82: Q167.3(E) R216.1
N$83: Q168.3(E) R218.1
N$84: Q169.3(E) R220.1
N$85: Q170.3(E) R222.1
N$86: Q171.3(E) R224.1
N$87: Q172.3(E) R226.1
N$88: Q173.3(E) R228.1
N$89: Q174.2(B) R229.2
N$90: Q174.3(E) R230.1
N$91: Q175.2(B) R231.2
N$92: R244.2 STOLP3.8
N$93: Q176.2(B) R233.2
N$94: R242.2 STOLP3.7
N$95: Q177.2(B) R235.2
N$96: R240.2 STOLP3.6
N$97: Q178.2(B) R237.2
N$98: R238.2 STOLP3.5
N$99: Q179.2(B) R239.2
N$100: R236.2 STOLP3.4
N$101: Q180.2(B) R241.2
N$102: R234.2 STOLP3.3
N$103: Q181.2(B) R243.2
N$104: R232.2 STOLP3.2
N$105: R230.2 STOLP3.1
N$106: Q175.3(E) R232.1
N$107: Q176.3(E) R234.1
N$108: Q177.3(E) R236.1
N$109: Q178.3(E) R238.1
N$110: Q179.3(E) R240.1
N$111: Q180.3(E) R242.1
N$112: Q181.3(E) R244.1
N$113: Q182.2(B) R245.2
N$114: Q182.3(E) R246.1
N$115: Q183.2(B) R247.2
N$116: R260.2 STOLP4.8
N$117: Q184.2(B) R249.2
N$118: R258.2 STOLP4.7
N$119: Q185.2(B) R251.2
N$120: R256.2 STOLP4.6
N$121: Q186.2(B) R253.2
N$122: R254.2 STOLP4.5
N$123: Q187.2(B) R255.2
N$124: R252.2 STOLP4.4
N$125: Q188.2(B) R257.2
N$126: R250.2 STOLP4.3
N$127: Q189.2(B) R259.2
N$128: R248.2 STOLP4.2
N$129: Q183.3(E) R248.1
N$130: Q184.3(E) R250.1
N$131: R246.2 STOLP4.1
N$132: Q185.3(E) R252.1
N$133: Q186.3(E) R254.1
N$134: Q187.3(E) R256.1
N$135: Q188.3(E) R258.1
N$136: Q189.3(E) R260.1
N$137: Q190.2(B) R261.2
N$138: R276.2 STOLP5.8
N$139: Q191.2(B) R263.2
N$140: R274.2 STOLP5.7
N$141: Q192.2(B) R265.2
N$142: R272.2 STOLP5.6
N$143: Q193.2(B) R267.2
N$144: R270.2 STOLP5.5
N$145: Q194.2(B) R269.2
N$146: R268.2 STOLP5.4
N$147: Q195.2(B) R271.2
N$148: R266.2 STOLP5.3
N$149: Q196.2(B) R273.2
N$150: R264.2 STOLP5.2
N$151: Q197.2(B) R275.2
N$152: R262.2 STOLP5.1
N$153: Q190.3(E) R262.1
N$154: Q191.3(E) R264.1
N$155: Q192.3(E) R266.1
N$156: Q193.3(E) R268.1
N$157: Q194.3(E) R270.1
N$158: Q195.3(E) R272.1
N$159: Q196.3(E) R274.1
N$160: Q197.3(E) R276.1
N$161: Q198.2(B) R277.2
N$162: R292.2 STOLP6.8
N$163: Q199.2(B) R279.2
N$164: R290.2 STOLP6.7
N$165: Q200.2(B) R281.2
N$166: R288.2 STOLP6.6
N$167: Q201.2(B) R283.2
N$168: R286.2 STOLP6.5
N$169: Q202.2(B) R285.2
N$170: R284.2 STOLP6.4
N$171: Q203.2(B) R287.2
N$172: R282.2 STOLP6.3
N$173: Q204.2(B) R289.2
N$174: R280.2 STOLP6.2
N$175: Q205.2(B) R291.2
N$176: R278.2 STOLP6.1
N$177: Q198.3(E) R278.1
N$178: Q199.3(E) R280.1
N$179: Q200.3(E) R282.1
N$180: Q201.3(E) R284.1
N$181: Q202.3(E) R286.1
N$182: Q203.3(E) R288.1
N$183: Q204.3(E) R290.1
N$184: Q205.3(E) R292.1
N$185: Q206.2(B) R293.2
N$186: Q206.3(E) R294.1
N$187: Q207.2(B) R295.2
N$188: R308.2 STOLP7.8
N$189: Q208.2(B) R297.2
N$190: R306.2 STOLP7.7
N$191: Q209.2(B) R299.2
N$192: R304.2 STOLP7.6
N$193: Q210.2(B) R301.2
N$194: R302.2 STOLP7.5
N$195: Q211.2(B) R303.2
N$196: R300.2 STOLP7.4
N$197: Q212.2(B) R305.2
N$198: R298.2 STOLP7.3
N$199: Q213.2(B) R307.2
N$200: R296.2 STOLP7.2
N$201: R294.2 STOLP7.1
N$202: Q207.3(E) R296.1
N$203: Q208.3(E) R298.1
N$204: Q209.3(E) R300.1
N$205: Q210.3(E) R302.1
N$206: Q211.3(E) R304.1
N$207: Q212.3(E) R306.1
N$208: Q213.3(E) R308.1
N$209: Q214.2(B) R309.2
N$210: R324.2 STOLP8.8
N$211: Q215.2(B) R311.2
N$212: R322.2 STOLP8.7
N$213: Q216.2(B) R313.2
N$214: R320.2 STOLP8.6
N$215: Q217.2(B) R315.2
N$216: R318.2 STOLP8.5
N$217: Q218.2(B) R317.2
N$218: R316.2 STOLP8.4
N$219: Q219.2(B) R319.2
N$220: R314.2 STOLP8.3
N$221: Q220.2(B) R321.2
N$222: R312.2 STOLP8.2
N$223: Q221.2(B) R323.2
N$224: R310.2 STOLP8.1
N$225: Q214.3(E) R310.1
N$226: Q215.3(E) R312.1
N$227: Q216.3(E) R314.1
N$228: Q217.3(E) R316.1
N$229: Q218.3(E) R318.1
N$230: Q219.3(E) R320.1
N$231: Q220.3(E) R322.1
N$232: Q221.3(E) R324.1
N$233: Q222.2(B) R325.2
N$234: Q286.3(E) R454.1
N$235: Q223.2(B) R327.2
N$236: R468.2 STOLP9.8
N$237: Q224.2(B) R329.2
N$238: R466.2 STOLP9.7
N$239: Q225.2(B) R331.2
N$240: R464.2 STOLP9.6
N$241: Q226.2(B) R333.2
N$242: R462.2 STOLP9.5
N$243: Q227.2(B) R335.2
N$244: R460.2 STOLP9.4
N$245: Q228.2(B) R337.2
N$246: R458.2 STOLP9.3
N$247: Q229.2(B) R339.2
N$248: R456.2 STOLP9.2
N$249: R454.2 STOLP9.1
N$250: Q287.3(E) R456.1
N$251: Q288.3(E) R458.1
N$252: Q289.3(E) R460.1
N$253: Q290.3(E) R462.1
N$254: Q291.3(E) R464.1
N$255: Q292.3(E) R466.1
N$256: Q293.3(E) R468.1
N$257: Q230.2(B) R341.2
N$258: Q294.3(E) R470.1
N$259: Q231.2(B) R343.2
N$260: R484.2 STOLP10.8
N$261: Q232.2(B) R345.2
N$262: R482.2 STOLP10.7
N$263: Q233.2(B) R347.2
N$264: R480.2 STOLP10.6
N$265: Q234.2(B) R349.2
N$266: R478.2 STOLP10.5
N$267: Q235.2(B) R351.2
N$268: R476.2 STOLP10.4
N$269: Q236.2(B) R353.2
N$270: R474.2 STOLP10.3
N$271: Q237.2(B) R355.2
N$272: R472.2 STOLP10.2
N$273: R470.2 STOLP10.1
N$274: Q295.3(E) R472.1
N$275: Q296.3(E) R474.1
N$276: Q297.3(E) R476.1
N$277: Q298.3(E) R478.1
N$278: Q299.3(E) R480.1
N$279: Q300.3(E) R482.1
N$280: Q301.3(E) R484.1
N$281: Q238.2(B) R357.2
N$282: R500.2 STOLP11.8
N$283: Q239.2(B) R359.2
N$284: R498.2 STOLP11.7
N$285: Q240.2(B) R361.2
N$286: R496.2 STOLP11.6
N$287: Q241.2(B) R363.2
N$288: R494.2 STOLP11.5
N$289: Q242.2(B) R365.2
N$290: R492.2 STOLP11.4
N$291: Q243.2(B) R367.2
N$292: R490.2 STOLP11.3
N$293: Q244.2(B) R369.2
N$294: R488.2 STOLP11.2
N$295: Q245.2(B) R371.2
N$296: R486.2 STOLP11.1
N$297: Q302.3(E) R486.1
N$298: Q303.3(E) R488.1
N$299: Q304.3(E) R490.1
N$300: Q305.3(E) R492.1
N$302: Q306.3(E) R494.1
N$303: Q307.3(E) R496.1
N$304: Q308.3(E) R498.1
N$305: Q246.2(B) R373.2
N$306: Q309.3(E) R500.1
N$307: Q247.2(B) R375.2
N$308: Q310.3(E) R502.1
N$309: Q248.2(B) R377.2
N$310: R516.2 STOLP12.8
N$311: Q249.2(B) R379.2
N$312: R514.2 STOLP12.7
N$313: Q250.2(B) R381.2
N$314: R512.2 STOLP12.6
N$315: Q251.2(B) R383.2
N$316: R510.2 STOLP12.5
N$317: Q252.2(B) R385.2
N$318: R508.2 STOLP12.4
N$319: Q253.2(B) R387.2
N$320: R506.2 STOLP12.3
N$321: R504.2 STOLP12.2
N$322: R502.2 STOLP12.1
N$323: Q311.3(E) R504.1
N$324: Q312.3(E) R506.1
N$325: Q313.3(E) R508.1
N$326: Q314.3(E) R510.1
N$327: Q315.3(E) R512.1
N$328: Q316.3(E) R514.1
N$329: Q254.2(B) R389.2
N$330: Q317.3(E) R516.1
N$331: Q255.2(B) R391.2
N$332: Q318.3(E) R518.1
N$333: Q256.2(B) R393.2
N$334: Q319.3(E) R520.1
N$335: Q257.2(B) R395.2
N$336: Q320.3(E) R522.1
N$337: Q258.2(B) R397.2
N$338: Q321.3(E) R524.1
N$339: Q259.2(B) R399.2
N$340: Q322.3(E) R526.1
N$341: Q260.2(B) R401.2
N$342: Q323.3(E) R528.1
N$343: Q261.2(B) R403.2
N$344: Q324.3(E) R530.1
N$345: Q325.3(E) R532.1
N$346: Q326.3(E) R534.1
N$347: R532.2 STOLP13.8
N$348: R530.2 STOLP13.7
N$349: R528.2 STOLP13.6
N$350: R526.2 STOLP13.5
N$351: R524.2 STOLP13.4
N$352: R522.2 STOLP13.3
N$353: Q262.2(B) R405.2
N$354: R520.2 STOLP13.2
N$355: Q263.2(B) R407.2
N$356: R518.2 STOLP13.1
N$357: Q264.2(B) R409.2
N$358: R548.2 STOLP14.8
N$359: Q265.2(B) R411.2
N$360: R546.2 STOLP14.7
N$361: Q266.2(B) R413.2
N$362: R544.2 STOLP14.6
N$363: Q267.2(B) R415.2
N$364: R542.2 STOLP14.5
N$365: Q268.2(B) R417.2
N$366: R540.2 STOLP14.4
N$367: Q269.2(B) R419.2
N$368: R538.2 STOLP14.3
N$369: R536.2 STOLP14.2
N$370: R534.2 STOLP14.1
N$371: Q327.3(E) R536.1
N$372: Q328.3(E) R538.1
N$373: Q329.3(E) R540.1
N$374: Q330.3(E) R542.1
N$375: Q331.3(E) R544.1
N$376: Q332.3(E) R546.1
N$377: Q270.2(B) R421.2
N$378: Q333.3(E) R548.1
N$379: Q271.2(B) R423.2
N$380: R564.2 STOLP15.8
N$381: Q272.2(B) R425.2
N$382: R562.2 STOLP15.7
N$383: Q273.2(B) R427.2
N$384: R560.2 STOLP15.6
N$385: Q274.2(B) R429.2
N$386: R558.2 STOLP15.5
N$387: Q275.2(B) R431.2
N$388: R556.2 STOLP15.4
N$389: Q276.2(B) R433.2
N$390: R554.2 STOLP15.3
N$391: Q277.2(B) R435.2
N$392: R552.2 STOLP15.2
N$393: R550.2 STOLP15.1
N$394: Q334.3(E) R550.1
N$395: Q335.3(E) R552.1
N$396: Q336.3(E) R554.1
N$397: Q337.3(E) R556.1
N$398: Q338.3(E) R558.1
N$399: Q339.3(E) R560.1
N$400: Q340.3(E) R562.1
N$401: Q278.2(B) R437.2
N$402: Q341.3(E) R564.1
N$403: Q279.2(B) R439.2
N$404: Q222.3(E) R326.1
N$405: Q280.2(B) R441.2
N$406: R340.2 STOL16.8
N$407: Q281.2(B) R443.2
N$408: R338.2 STOL16.7
N$409: Q282.2(B) R445.2
N$410: R336.2 STOL16.6
N$411: Q283.2(B) R447.2
N$412: R334.2 STOL16.5
N$413: Q284.2(B) R449.2
N$414: R332.2 STOL16.4
N$415: Q285.2(B) R451.2
N$416: R330.2 STOL16.3
N$417: R328.2 STOL16.2
N$418: R326.2 STOL16.1
N$419: Q223.3(E) R328.1
N$420: Q224.3(E) R330.1
N$421: Q225.3(E) R332.1
N$422: Q226.3(E) R334.1
N$423: Q227.3(E) R336.1
N$424: Q228.3(E) R338.1
N$425: Q286.2(B) R453.2
N$426: Q229.3(E) R340.1
N$427: Q287.2(B) R455.2
N$428: R356.2 STOLP17.8
N$429: Q288.2(B) R457.2
N$430: R354.2 STOLP17.7
N$431: Q289.2(B) R459.2
N$432: R352.2 STOLP17.6
N$433: Q290.2(B) R461.2
N$434: R350.2 STOLP17.5
N$435: Q291.2(B) R463.2
N$436: R348.2 STOLP17.4
N$437: Q292.2(B) R465.2
N$438: R346.2 STOLP17.3
N$439: Q293.2(B) R467.2
N$440: R344.2 STOLP17.2
N$441: R342.2 STOLP17.1
N$442: Q230.3(E) R342.1
N$443: Q231.3(E) R344.1
N$444: Q232.3(E) R346.1
N$445: Q233.3(E) R348.1
N$446: Q234.3(E) R350.1
N$447: Q235.3(E) R352.1
N$448: Q236.3(E) R354.1
N$449: Q294.2(B) R469.2
N$450: Q237.3(E) R356.1
N$451: Q295.2(B) R471.2
N$452: R372.2 STOLP18.8
N$453: Q296.2(B) R473.2
N$454: R370.2 STOLP18.7
N$455: Q297.2(B) R475.2
N$456: R368.2 STOLP18.6
N$457: Q298.2(B) R477.2
N$458: R366.2 STOLP18.5
N$459: Q299.2(B) R479.2
N$460: R364.2 STOLP18.4
N$461: Q300.2(B) R481.2
N$462: R362.2 STOLP18.3
N$463: Q301.2(B) R483.2
N$464: R360.2 STOLP18.2
N$465: R358.2 STOLP18.1
N$466: Q238.3(E) R358.1
N$467: Q239.3(E) R360.1
N$468: Q240.3(E) R362.1
N$469: Q241.3(E) R364.1
N$470: Q242.3(E) R366.1
N$471: Q243.3(E) R368.1
N$472: Q244.3(E) R370.1
N$473: Q302.2(B) R485.2
N$474: Q245.3(E) R372.1
N$475: Q303.2(B) R487.2
N$476: R388.2 STOLP19.8
N$477: Q304.2(B) R489.2
N$478: R386.2 STOLP19.7
N$479: Q305.2(B) R491.2
N$480: R384.2 STOLP19.6
N$481: Q306.2(B) R493.2
N$482: R382.2 STOLP19.5
N$483: Q307.2(B) R495.2
N$484: R380.2 STOLP19.4
N$485: Q308.2(B) R497.2
N$486: R378.2 STOLP19.3
N$487: Q309.2(B) R499.2
N$488: R376.2 STOLP19.2
N$489: R374.2 STOLP19.1
N$490: Q246.3(E) R374.1
N$491: Q247.3(E) R376.1
N$492: Q248.3(E) R378.1
N$493: Q249.3(E) R380.1
N$494: Q250.3(E) R382.1
N$495: Q251.3(E) R384.1
N$496: Q252.3(E) R386.1
N$497: Q310.2(B) R501.2
N$498: Q253.3(E) R388.1
N$499: Q311.2(B) R503.2
N$500: Q254.3(E) R390.1
N$501: Q312.2(B) R505.2
N$502: R404.2 STOLP20.8
N$503: Q313.2(B) R507.2
N$504: R402.2 STOLP20.7
N$505: Q314.2(B) R509.2
N$506: R400.2 STOLP20.6
N$507: Q315.2(B) R511.2
N$508: R398.2 STOLP20.5
N$509: Q316.2(B) R513.2
N$510: R396.2 STOLP20.4
N$511: Q317.2(B) R515.2
N$512: R394.2 STOLP20.3
N$513: R392.2 STOLP20.2
N$514: R390.2 STOLP20.1
N$515: Q255.3(E) R392.1
N$516: Q256.3(E) R394.1
N$517: Q257.3(E) R396.1
N$518: Q258.3(E) R398.1
N$519: Q259.3(E) R400.1
N$520: Q260.3(E) R402.1
N$521: Q318.2(B) R517.2
N$522: Q261.3(E) R404.1
N$523: Q319.2(B) R519.2
N$524: R420.2 STOLP21.8
N$525: Q320.2(B) R521.2
N$526: R418.2 STOLP21.7
N$527: Q321.2(B) R523.2
N$528: R416.2 STOLP21.6
N$529: Q322.2(B) R525.2
N$530: R414.2 STOLP21.5
N$531: Q323.2(B) R527.2
N$532: R412.2 STOLP21.4
N$533: Q324.2(B) R529.2
N$534: R410.2 STOLP21.3
N$535: Q325.2(B) R531.2
N$536: R408.2 STOLP21.2
N$537: R406.2 STOLP21.1
N$538: Q262.3(E) R406.1
N$539: Q263.3(E) R408.1
N$540: Q264.3(E) R410.1
N$541: Q265.3(E) R412.1
N$542: Q266.3(E) R414.1
N$543: Q267.3(E) R416.1
N$544: Q268.3(E) R418.1
N$545: Q326.2(B) R533.2
N$546: Q269.3(E) R420.1
N$547: Q327.2(B) R535.2
N$548: Q270.3(E) R422.1
N$549: Q328.2(B) R537.2
N$550: R436.2 STOLP22.8
N$551: Q329.2(B) R539.2
N$552: R434.2 STOLP22.7
N$553: Q330.2(B) R541.2
N$554: R432.2 STOLP22.6
N$555: Q331.2(B) R543.2
N$556: R430.2 STOLP22.5
N$557: Q332.2(B) R545.2
N$558: R428.2 STOLP22.4
N$559: Q333.2(B) R547.2
N$560: R426.2 STOLP22.3
N$561: R424.2 STOLP22.2
N$562: R422.2 STOLP22.1
N$563: Q271.3(E) R424.1
N$564: Q272.3(E) R426.1
N$565: Q273.3(E) R428.1
N$566: Q274.3(E) R430.1
N$567: Q275.3(E) R432.1
N$568: Q276.3(E) R434.1
N$569: Q334.2(B) R549.2
N$570: Q277.3(E) R436.1
N$571: Q335.2(B) R551.2
N$572: R452.2 STOLP23.8
N$573: Q336.2(B) R553.2
N$574: R450.2 STOLP23.7
N$575: Q337.2(B) R555.2
N$576: R448.2 STOLP23.6
N$577: Q338.2(B) R557.2
N$578: R446.2 STOLP23.5
N$579: Q339.2(B) R559.2
N$580: R444.2 STOLP23.4
N$581: Q340.2(B) R561.2
N$582: R442.2 STOLP23.3
N$583: Q341.2(B) R563.2
N$584: R440.2 STOLP23.2
N$585: R438.2 STOLP23.1
N$586: Q278.3(E) R438.1
N$587: Q279.3(E) R440.1
N$588: Q280.3(E) R442.1
N$589: Q281.3(E) R444.1
N$590: Q282.3(E) R446.1
N$591: Q283.3(E) R448.1
N$592: Q284.3(E) R450.1
N$601: Q285.3(E) R452.1
N$603: IC1.20(VCC) IC2.20(VCC) IC3.20(VCC) IC4.20(VCC) IC5.20(VCC) IC6.20(VCC) IC7.20(VCC) IC8.20(VCC) IC9.20(VCC) IC10.20(VCC) IC11.20(VCC) IC12.20(VCC) IC13.20(VCC) IC14.20(VCC) IC15.20(VCC) IC16.20(VCC) IC17.20(VCC) IC18.20(VCC) IC19.20(VCC) IC20.20(VCC) IC21.20(VCC) IC22.20(VCC) IC23.20(VCC) IC24.20(VCC) JP2.4 OMOGOCANJE_BLUE.6(G1) OMOGOCANJE_BLUE.16(VCC) OMOGOCANJE_GREEN.6(G1) OMOGOCANJE_GREEN.16(VCC) OMOGOCANJE_RED.6(G1) OMOGOCANJE_RED.16(VCC) PUKLOP.6(G1) PUKLOP.16(VCC) TRAFO.2 UKLOP_COMMON.6(G1) UKLOP_COMMON.16(VCC) ; supply symbol labelled V+
OMOGOCANJE0: JP1.6 OMOGOCANJE_RED.3(C)
OMOGOCANJE1: JP1.7 OMOGOCANJE_RED.2(B)
OMOGOCANJE2: JP1.8 OMOGOCANJE_RED.1(A)
OMOGOCANJE3: JP1.9 OMOGOCANJE_GREEN.3(C)
OMOGOCANJE4: JP1.10 OMOGOCANJE_GREEN.2(B)
OMOGOCANJE5: JP1.11 OMOGOCANJE_GREEN.1(A)
OMOGOCANJE6: JP1.12 OMOGOCANJE_BLUE.3(C)
OMOGOCANJE7: JP1.13 OMOGOCANJE_BLUE.2(B)
OMOGOCANJE8: JP1.14 OMOGOCANJE_BLUE.1(A)
OMOGOCANJEA0: IC1.11(CLK) OMOGOCANJE_RED.15(Y0)
OMOGOCANJEA1: IC2.11(CLK) OMOGOCANJE_RED.14(Y1)
OMOGOCANJEA2: IC3.11(CLK) OMOGOCANJE_RED.13(Y2)
OMOGOCANJEA3: IC4.11(CLK) OMOGOCANJE_RED.12(Y3)
OMOGOCANJEA4: IC5.11(CLK) OMOGOCANJE_RED.11(Y4)
OMOGOCANJEA5: IC6.11(CLK) OMOGOCANJE_RED.10(Y5)
OMOGOCANJEA6: IC7.11(CLK) OMOGOCANJE_RED.9(Y6)
OMOGOCANJEA7: IC8.11(CLK) OMOGOCANJE_RED.7(Y7)
OMOGOCANJEB0: IC9.11(CLK) OMOGOCANJE_GREEN.15(Y0)
OMOGOCANJEB1: IC10.11(CLK) OMOGOCANJE_GREEN.14(Y1)
OMOGOCANJEB2: IC11.11(CLK) OMOGOCANJE_GREEN.13(Y2)
OMOGOCANJEB3: IC12.11(CLK) OMOGOCANJE_GREEN.12(Y3)
OMOGOCANJEB4: IC13.11(CLK) OMOGOCANJE_GREEN.11(Y4)
OMOGOCANJEB5: IC14.11(CLK) OMOGOCANJE_GREEN.10(Y5)
OMOGOCANJEB6: IC15.11(CLK) OMOGOCANJE_GREEN.9(Y6)
OMOGOCANJEB7: IC16.11(CLK) OMOGOCANJE_GREEN.7(Y7)
OMOGOCANJEC0: IC17.11(CLK) OMOGOCANJE_BLUE.15(Y0)
OMOGOCANJEC1: IC18.11(CLK) OMOGOCANJE_BLUE.14(Y1)
OMOGOCANJEC2: IC19.11(CLK) OMOGOCANJE_BLUE.13(Y2)
OMOGOCANJEC3: IC20.11(CLK) OMOGOCANJE_BLUE.12(Y3)
OMOGOCANJEC4: IC21.11(CLK) OMOGOCANJE_BLUE.11(Y4)
OMOGOCANJEC5: IC22.11(CLK) OMOGOCANJE_BLUE.10(Y5)
OMOGOCANJEC6: IC23.11(CLK) OMOGOCANJE_BLUE.9(Y6)
OMOGOCANJEC7: IC24.11(CLK) OMOGOCANJE_BLUE.7(Y7)
SKUPNA0: R198.1 UKLOP_COMMON.15(Y0)
SKUPNA1: R196.1 UKLOP_COMMON.14(Y1)
SKUPNA2: R195.1 UKLOP_COMMON.13(Y2)
SKUPNA3: R191.1 UKLOP_COMMON.12(Y3)
SKUPNA4: R192.1 UKLOP_COMMON.11(Y4)
SKUPNA5: R193.1 UKLOP_COMMON.10(Y5)
SKUPNA6: R197.1 UKLOP_COMMON.9(Y6)
SKUPNA7: R194.1 UKLOP_COMMON.7(Y7)
UKLOP0: IC1.2(1D) IC2.2(1D) IC3.2(1D) IC4.2(1D) IC5.2(1D) IC6.2(1D) IC7.2(1D) IC8.2(1D) IC9.2(1D) IC10.2(1D) IC11.2(1D) IC12.2(1D) IC13.2(1D) IC14.2(1D) IC15.2(1D) IC16.2(1D) IC17.2(1D) IC18.2(1D) IC19.2(1D) IC20.2(1D) IC21.2(1D) IC22.2(1D) IC23.2(1D) IC24.2(1D) PUKLOP.15(Y0)
UKLOP1: IC1.3(2D) IC2.3(2D) IC3.3(2D) IC4.3(2D) IC5.3(2D) IC6.3(2D) IC7.3(2D) IC8.3(2D) IC9.3(2D) IC11.3(2D) IC12.3(2D) IC13.3(2D) IC14.3(2D) IC15.3(2D) IC16.3(2D) IC17.3(2D) IC18.3(2D) IC19.3(2D) IC20.3(2D) IC21.3(2D) IC22.3(2D) IC23.3(2D) IC24.3(2D) PUKLOP.14(Y1)
UKLOP2: IC2.4(3D) IC3.4(3D) IC4.4(3D) IC5.4(3D) IC6.4(3D) IC7.4(3D) IC8.4(3D) IC9.4(3D) IC10.4(3D) IC11.4(3D) IC12.4(3D) IC13.4(3D) IC14.4(3D) IC15.4(3D) IC16.4(3D) IC17.4(3D) IC18.4(3D) IC19.4(3D) IC20.4(3D) IC21.4(3D) IC22.4(3D) IC23.4(3D) IC24.4(3D) PUKLOP.13(Y2)
UKLOP3: IC1.5(4D) IC2.5(4D) IC3.5(4D) IC4.5(4D) IC5.5(4D) IC6.5(4D) IC7.5(4D) IC8.5(4D) IC9.5(4D) IC10.5(4D) IC11.5(4D) IC12.5(4D) IC13.5(4D) IC14.5(4D) IC15.5(4D) IC16.5(4D) IC17.5(4D) IC18.5(4D) IC19.5(4D) IC20.5(4D) IC21.5(4D) IC22.5(4D) IC23.5(4D) IC24.5(4D) PUKLOP.12(Y3)
UKLOP4: IC1.6(5D) IC2.6(5D) IC3.6(5D) IC4.6(5D) IC5.6(5D) IC6.6(5D) IC7.6(5D) IC8.6(5D) IC9.6(5D) IC10.6(5D) IC11.6(5D) IC12.6(5D) IC13.6(5D) IC14.6(5D) IC15.6(5D) IC16.6(5D) IC17.6(5D) IC18.6(5D) IC19.6(5D) IC20.6(5D) IC21.6(5D) IC22.6(5D) IC23.6(5D) IC24.6(5D) PUKLOP.11(Y4)
UKLOP5: IC1.7(6D) IC2.7(6D) IC3.7(6D) IC4.7(6D) IC5.7(6D) IC6.7(6D) IC7.7(6D) IC8.7(6D) IC9.7(6D) IC10.7(6D) IC11.7(6D) IC12.7(6D) IC13.7(6D) IC14.7(6D) IC15.7(6D) IC16.7(6D) IC17.7(6D) IC18.7(6D) IC19.7(6D) IC20.7(6D) IC21.7(6D) IC22.7(6D) IC23.7(6D) IC24.7(6D) PUKLOP.10(Y5)
UKLOP6: IC1.8(7D) IC2.8(7D) IC3.8(7D) IC4.8(7D) IC5.8(7D) IC6.8(7D) IC7.8(7D) IC8.8(7D) IC10.8(7D) IC11.8(7D) IC12.8(7D) IC13.8(7D) IC14.8(7D) IC15.8(7D) IC16.8(7D) IC17.8(7D) IC18.8(7D) IC19.8(7D) IC20.8(7D) IC21.8(7D) IC22.8(7D) IC23.8(7D) IC24.8(7D) PUKLOP.9(Y6)
UKLOP7: IC1.9(8D) IC2.9(8D) IC3.9(8D) IC4.9(8D) IC5.9(8D) IC6.9(8D) IC7.9(8D) IC8.9(8D) IC9.9(8D) IC10.9(8D) IC11.9(8D) IC12.9(8D) IC13.9(8D) IC14.9(8D) IC15.9(8D) IC16.9(8D) IC17.9(8D) IC18.9(8D) IC19.9(8D) IC20.9(8D) IC21.9(8D) IC22.9(8D) IC23.9(8D) IC24.9(8D) PUKLOP.7(Y7)
UKLOP-KOCKA8: IC1.19(1Q) R2.1
UKLOP-KOCKA9: IC1.18(2Q) R1.1
UKLOP-KOCKA10: IC1.17(3Q) R4.1
UKLOP-KOCKA11: IC1.16(4Q) R8.1
UKLOP-KOCKA12: IC1.15(5Q) R10.1
UKLOP-KOCKA13: IC1.14(6Q) R201.1
UKLOP-KOCKA14: IC1.13(7Q) R203.1
UKLOP-KOCKA15: IC1.12(8Q) R205.1
UKLOP-KOCKA16: IC2.19(1Q) R6.1
UKLOP-KOCKA17: IC2.18(2Q) R13.1
UKLOP-KOCKA18: IC2.17(3Q) R15.1
UKLOP-KOCKA19: IC2.16(4Q) R17.1
UKLOP-KOCKA20: IC2.15(5Q) R19.1
UKLOP-KOCKA21: IC2.14(6Q) R207.1
UKLOP-KOCKA22: IC2.13(7Q) R209.1
UKLOP-KOCKA23: IC2.12(8Q) R211.1
UKLOP-KOCKA24: IC3.19(1Q) R213.1
UKLOP-KOCKA25: IC3.18(2Q) R215.1
UKLOP-KOCKA26: IC3.17(3Q) R217.1
UKLOP-KOCKA27: IC3.16(4Q) R219.1
UKLOP-KOCKA28: IC3.15(5Q) R221.1
UKLOP-KOCKA29: IC3.14(6Q) R223.1
UKLOP-KOCKA30: IC3.13(7Q) R225.1
UKLOP-KOCKA31: IC3.12(8Q) R227.1
UKLOP-KOCKA32: IC4.19(1Q) R229.1
UKLOP-KOCKA33: IC4.18(2Q) R231.1
UKLOP-KOCKA34: IC4.17(3Q) R233.1
UKLOP-KOCKA35: IC4.16(4Q) R235.1
UKLOP-KOCKA36: IC4.15(5Q) R237.1
UKLOP-KOCKA37: IC4.14(6Q) R239.1
UKLOP-KOCKA38: IC4.13(7Q) R241.1
UKLOP-KOCKA39: IC4.12(8Q) R243.1
UKLOP-KOCKA40: IC5.19(1Q) R245.1
UKLOP-KOCKA41: IC5.18(2Q) R247.1
UKLOP-KOCKA42: IC5.17(3Q) R249.1
UKLOP-KOCKA43: IC5.16(4Q) R251.1
UKLOP-KOCKA44: IC5.15(5Q) R253.1
UKLOP-KOCKA45: IC5.14(6Q) R255.1
UKLOP-KOCKA46: IC5.13(7Q) R257.1
UKLOP-KOCKA47: IC5.12(8Q) R259.1
UKLOP-KOCKA48: IC6.19(1Q) R261.1
UKLOP-KOCKA49: IC6.18(2Q) R263.1
UKLOP-KOCKA50: IC6.17(3Q) R265.1
UKLOP-KOCKA51: IC6.16(4Q) R267.1
UKLOP-KOCKA52: IC6.15(5Q) R269.1
UKLOP-KOCKA53: IC6.14(6Q) R271.1
UKLOP-KOCKA54: IC6.13(7Q) R273.1
UKLOP-KOCKA55: IC6.12(8Q) R275.1
UKLOP-KOCKA56: IC7.19(1Q) R277.1
UKLOP-KOCKA57: IC7.18(2Q) R279.1
UKLOP-KOCKA58: IC7.17(3Q) R281.1
UKLOP-KOCKA59: IC7.16(4Q) R283.1
UKLOP-KOCKA60: IC7.15(5Q) R285.1
UKLOP-KOCKA61: IC7.14(6Q) R287.1
UKLOP-KOCKA62: IC7.13(7Q) R289.1
UKLOP-KOCKA63: IC7.12(8Q) R291.1
UKLOP-KOCKA64: IC8.19(1Q) R293.1
UKLOP-KOCKA65: IC8.18(2Q) R295.1
UKLOP-KOCKA66: IC8.17(3Q) R297.1
UKLOP-KOCKA67: IC8.16(4Q) R299.1
UKLOP-KOCKA68: IC8.15(5Q) R301.1
UKLOP-KOCKA69: IC8.14(6Q) R303.1
UKLOP-KOCKA70: IC8.13(7Q) R305.1
UKLOP-KOCKA71: IC8.12(8Q) R307.1
UKLOP-KOCKA72: IC9.19(1Q) R309.1
UKLOP-KOCKA73: IC9.18(2Q) R311.1
UKLOP-KOCKA74: IC9.17(3Q) R313.1
UKLOP-KOCKA75: IC9.16(4Q) R315.1
UKLOP-KOCKA76: IC9.15(5Q) R317.1
UKLOP-KOCKA77: IC9.14(6Q) R319.1
UKLOP-KOCKA78: IC9.13(7Q) R321.1
UKLOP-KOCKA79: IC9.12(8Q) R323.1
UKLOP-KOCKA80: IC10.19(1Q) R453.1
UKLOP-KOCKA81: IC10.18(2Q) R455.1
UKLOP-KOCKA82: IC10.17(3Q) R457.1
UKLOP-KOCKA83: IC10.16(4Q) R459.1
UKLOP-KOCKA84: IC10.15(5Q) R461.1
UKLOP-KOCKA85: IC10.14(6Q) R463.1
UKLOP-KOCKA86: IC10.13(7Q) R465.1
UKLOP-KOCKA87: IC10.12(8Q) R467.1
UKLOP-KOCKA88: IC11.19(1Q) R469.1
UKLOP-KOCKA89: IC11.18(2Q) R471.1
UKLOP-KOCKA90: IC11.17(3Q) R473.1
UKLOP-KOCKA91: IC11.16(4Q) R475.1
UKLOP-KOCKA92: IC11.15(5Q) R477.1
UKLOP-KOCKA93: IC11.14(6Q) R479.1
UKLOP-KOCKA94: IC11.13(7Q) R481.1
UKLOP-KOCKA95: IC11.12(8Q) R483.1
UKLOP-KOCKA96: IC12.19(1Q) R485.1
UKLOP-KOCKA97: IC12.18(2Q) R487.1
UKLOP-KOCKA98: IC12.17(3Q) R489.1
UKLOP-KOCKA99: IC12.16(4Q) R491.1
UKLOP-KOCKA100: IC12.15(5Q) R493.1
UKLOP-KOCKA101: IC12.14(6Q) R495.1
UKLOP-KOCKA102: IC12.13(7Q) R497.1
UKLOP-KOCKA103: IC12.12(8Q) R499.1
UKLOP-KOCKA104: IC13.19(1Q) R501.1
UKLOP-KOCKA105: IC13.18(2Q) R503.1
UKLOP-KOCKA106: IC13.17(3Q) R505.1
UKLOP-KOCKA107: IC13.16(4Q) R507.1
UKLOP-KOCKA108: IC13.15(5Q) R509.1
UKLOP-KOCKA109: IC13.14(6Q) R511.1
UKLOP-KOCKA110: IC13.13(7Q) R513.1
UKLOP-KOCKA111: IC13.12(8Q) R515.1
UKLOP-KOCKA112: IC14.19(1Q) R517.1
UKLOP-KOCKA113: IC14.18(2Q) R519.1
UKLOP-KOCKA114: IC14.17(3Q) R521.1
UKLOP-KOCKA115: IC14.16(4Q) R523.1
UKLOP-KOCKA116: IC14.15(5Q) R525.1
UKLOP-KOCKA117: IC14.14(6Q) R527.1
UKLOP-KOCKA118: IC14.13(7Q) R529.1
UKLOP-KOCKA119: IC14.12(8Q) R531.1
UKLOP-KOCKA120: IC15.19(1Q) R533.1
UKLOP-KOCKA121: IC15.18(2Q) R535.1
UKLOP-KOCKA122: IC15.17(3Q) R537.1
UKLOP-KOCKA123: IC15.16(4Q) R539.1
UKLOP-KOCKA124: IC15.15(5Q) R541.1
UKLOP-KOCKA125: IC15.14(6Q) R543.1
UKLOP-KOCKA126: IC15.13(7Q) R545.1
UKLOP-KOCKA127: IC15.12(8Q) R547.1
UKLOP-KOCKA128: IC16.19(1Q) R549.1
UKLOP-KOCKA129: IC16.18(2Q) R551.1
UKLOP-KOCKA130: IC16.17(3Q) R553.1
UKLOP-KOCKA131: IC16.16(4Q) R555.1
UKLOP-KOCKA132: IC16.15(5Q) R557.1
UKLOP-KOCKA133: IC16.14(6Q) R559.1
UKLOP-KOCKA134: IC16.13(7Q) R561.1
UKLOP-KOCKA135: IC16.12(8Q) R563.1
UKLOP-KOCKA136: IC17.19(1Q) R325.1
UKLOP-KOCKA137: IC17.18(2Q) R327.1
UKLOP-KOCKA138: IC17.17(3Q) R329.1
UKLOP-KOCKA139: IC17.16(4Q) R331.1
UKLOP-KOCKA140: IC17.15(5Q) R333.1
UKLOP-KOCKA141: IC17.14(6Q) R335.1
UKLOP-KOCKA142: IC17.13(7Q) R337.1
UKLOP-KOCKA143: IC17.12(8Q) R339.1
UKLOP-KOCKA144: IC18.19(1Q) R341.1
UKLOP-KOCKA145: IC18.18(2Q) R343.1
UKLOP-KOCKA146: IC18.17(3Q) R345.1
UKLOP-KOCKA147: IC18.16(4Q) R347.1
UKLOP-KOCKA148: IC18.15(5Q) R349.1
UKLOP-KOCKA149: IC18.14(6Q) R351.1
UKLOP-KOCKA150: IC18.13(7Q) R353.1
UKLOP-KOCKA151: IC18.12(8Q) R355.1
UKLOP-KOCKA152: IC19.19(1Q) R357.1
UKLOP-KOCKA153: IC19.18(2Q) R359.1
UKLOP-KOCKA154: IC19.17(3Q) R361.1
UKLOP-KOCKA155: IC19.16(4Q) R363.1
UKLOP-KOCKA156: IC19.15(5Q) R365.1
UKLOP-KOCKA157: IC19.14(6Q) R367.1
UKLOP-KOCKA158: IC19.13(7Q) R369.1
UKLOP-KOCKA159: IC19.12(8Q) R371.1
UKLOP-KOCKA160: IC20.19(1Q) R373.1
UKLOP-KOCKA161: IC20.18(2Q) R375.1
UKLOP-KOCKA162: IC20.17(3Q) R377.1
UKLOP-KOCKA163: IC20.16(4Q) R379.1
UKLOP-KOCKA164: IC20.15(5Q) R381.1
UKLOP-KOCKA165: IC20.14(6Q) R383.1
UKLOP-KOCKA166: IC20.13(7Q) R385.1
UKLOP-KOCKA167: IC20.12(8Q) R387.1
UKLOP-KOCKA168: IC21.19(1Q) R389.1
UKLOP-KOCKA169: IC21.18(2Q) R391.1
UKLOP-KOCKA170: IC21.17(3Q) R393.1
UKLOP-KOCKA171: IC21.16(4Q) R395.1
UKLOP-KOCKA172: IC21.15(5Q) R397.1
UKLOP-KOCKA173: IC21.14(6Q) R399.1
UKLOP-KOCKA174: IC21.13(7Q) R401.1
UKLOP-KOCKA175: IC21.12(8Q) R403.1
UKLOP-KOCKA176: IC22.19(1Q) R405.1
UKLOP-KOCKA177: IC22.18(2Q) R407.1
UKLOP-KOCKA178: IC22.17(3Q) R409.1
UKLOP-KOCKA179: IC22.16(4Q) R411.1
UKLOP-KOCKA180: IC22.15(5Q) R413.1
UKLOP-KOCKA181: IC22.14(6Q) R415.1
UKLOP-KOCKA182: IC22.13(7Q) R417.1
UKLOP-KOCKA183: IC22.12(8Q) R419.1
UKLOP-KOCKA184: IC23.19(1Q) R421.1
UKLOP-KOCKA185: IC23.18(2Q) R423.1
UKLOP-KOCKA186: IC23.17(3Q) R425.1
UKLOP-KOCKA187: IC23.16(4Q) R427.1
UKLOP-KOCKA188: IC23.15(5Q) R429.1
UKLOP-KOCKA189: IC23.14(6Q) R431.1
UKLOP-KOCKA190: IC23.13(7Q) R433.1
UKLOP-KOCKA191: IC23.12(8Q) R435.1
UKLOP-KOCKA192: IC24.19(1Q) R437.1
UKLOP-KOCKA193: IC24.18(2Q) R439.1
UKLOP-KOCKA194: IC24.17(3Q) R441.1
UKLOP-KOCKA195: IC24.16(4Q) R443.1
UKLOP-KOCKA196: IC24.15(5Q) R445.1
UKLOP-KOCKA197: IC24.14(6Q) R447.1
UKLOP-KOCKA198: IC24.13(7Q) R449.1
UKLOP-KOCKA199: IC24.12(8Q) R451.1
UKLOP_A0: JP2.12 PUKLOP.2(B)
UKLOP_A1: JP2.15 PUKLOP.1(A)
UKLOP_A2: JP1.15 PUKLOP.3(C)
V+: Q1.1(C) Q2.1(C) Q3.1(C) Q4.1(C) Q5.1(C) Q6.1(C) Q7.1(C) Q157.1(C) Q158.1(C) Q159.1(C) Q160.1(C) Q161.1(C) Q162.1(C) Q163.1(C) Q164.1(C) Q165.1(C) Q166.1(C) Q167.1(C) Q168.1(C) Q169.1(C) Q170.1(C) Q171.1(C) Q172.1(C) Q173.1(C) Q174.1(C) Q175.1(C) Q176.1(C) Q177.1(C) Q178.1(C) Q179.1(C) Q180.1(C) Q181.1(C) Q182.1(C) Q183.1(C) Q184.1(C) Q186.1(C) Q187.1(C) Q188.1(C) Q189.1(C) Q190.1(C) Q191.1(C) Q192.1(C) Q193.1(C) Q194.1(C) Q195.1(C) Q196.1(C) Q197.1(C) Q198.1(C) Q199.1(C) Q200.1(C) Q201.1(C) Q202.1(C) Q203.1(C) Q204.1(C) Q205.1(C) Q206.1(C) Q207.1(C) Q208.1(C) Q209.1(C) Q210.1(C) Q211.1(C) Q212.1(C) Q213.1(C) Q214.1(C) Q215.1(C) Q216.1(C) Q217.1(C) Q218.1(C) Q219.1(C) Q220.1(C) Q221.1(C) Q222.1(C) Q223.1(C) Q224.1(C) Q225.1(C) Q226.1(C) Q227.1(C) Q228.1(C) Q229.1(C) Q230.1(C) Q231.1(C) Q232.1(C) Q233.1(C) Q234.1(C) Q235.1(C) Q236.1(C) Q237.1(C) Q238.1(C) Q239.1(C) Q240.1(C) Q241.1(C) Q242.1(C) Q243.1(C) Q244.1(C) Q245.1(C) Q246.1(C) Q247.1(C) Q248.1(C) Q249.1(C) Q250.1(C) Q251.1(C) Q252.1(C) Q253.1(C) Q254.1(C) Q255.1(C) Q256.1(C) Q257.1(C) Q258.1(C) Q259.1(C) Q260.1(C) Q261.1(C) Q262.1(C) Q263.1(C) Q264.1(C) Q265.1(C) Q266.1(C) Q267.1(C) Q268.1(C) Q269.1(C) Q270.1(C) Q271.1(C) Q272.1(C) Q273.1(C) Q274.1(C) Q275.1(C) Q276.1(C) Q277.1(C) Q278.1(C) Q279.1(C) Q280.1(C) Q281.1(C) Q282.1(C) Q283.1(C) Q284.1(C) Q285.1(C) Q286.1(C) Q287.1(C) Q288.1(C) Q289.1(C) Q290.1(C) Q291.1(C) Q292.1(C) Q293.1(C) Q294.1(C) Q295.1(C) Q296.1(C) Q297.1(C) Q298.1(C) Q299.1(C) Q300.1(C) Q301.1(C) Q302.1(C) Q303.1(C) Q304.1(C) Q305.1(C) Q306.1(C) Q307.1(C) Q308.1(C) Q309.1(C) Q310.1(C) Q311.1(C) Q312.1(C) Q313.1(C) Q314.1(C) Q315.1(C) Q316.1(C) Q317.1(C) Q318.1(C) Q319.1(C) Q320.1(C) Q321.1(C) Q322.1(C) Q323.1(C) Q324.1(C) Q325.1(C) Q326.1(C) Q327.1(C) Q328.1(C) Q329.1(C) Q330.1(C) Q331.1(C) Q332.1(C) Q333.1(C) Q334.1(C) Q335.1(C) Q336.1(C) Q337.1(C) Q338.1(C) Q339.1(C) Q340.1(C) Q341.1(C)
Unconnected: IC1.4(3D) IC9.8(7D) IC10.3(2D) JP1.3 JP2.1 JP2.3 JP2.5 JP2.6 JP2.7 JP2.8 JP2.9 JP2.10 JP2.11 JP2.13 JP2.14 Q185.1(C)

### Buses
UKLOP-KOCKA[0..199]
OMOGOCANJEA[0..7]
OMOGOCANJEB[0..7]
OMOGOCANJEC[0..7]
SKUPNA[0..7]
COMMON[0..2]
OMOGOCANJE[0..8]
UKLOP_A[0..2]

## Sheet 2 of 2

## Library data of the parts
H5-H16 = holes:MOUNT-HOLE: MOUNTING HOLE with drill center marker
IC1-IC24 = 74xx-us:74*574: 8-bit D type FLIP FLOP bus driver
JP1 JP2 = pinhead:PINHD-1X15: PIN HEADER
OMOGOCANJE_BLUE OMOGOCANJE_GREEN OMOGOCANJE_RED PUKLOP UKLOP_COMMON = 74xx-eu:74*138: 3-line to 8-line DECODER/DEMULTIPLEXER
Q1-Q7 Q157-Q341 = transistor-npn:2N3904: NPN Transistor
Q149-Q156 = transistor-power:BD139: NPN TRANSISTOR
R1-R20 R191-R198 R201-R564 = rcl:R-EU_: RESISTOR, European symbol
STOL16 STOLP STOLP1-STOLP15 STOLP17-STOLP23 UKLOP_SKUPNO = pinhead:PINHD-1X8: PIN HEADER
TRAFO = con-ptr500:AK300/2: CONNECTOR; OC_FARNELL: unknown; OC_NEWARK: unknown